# EasyEDA Pro project SAM-2.eprj, schematic Schematic1

## Sheets
1 Universal Inputs: Board Name: SAM-25; Create Date: 2026-07-15; Page Name: Universal Inputs; Project Name: SAM-2; Schematic Name: Schematic1; Update Date: 2026-08-26; Company: ZyntelliTech Development LLC; Drawn: Stephen Long Jr; Page Size: A4; Version: V1.0
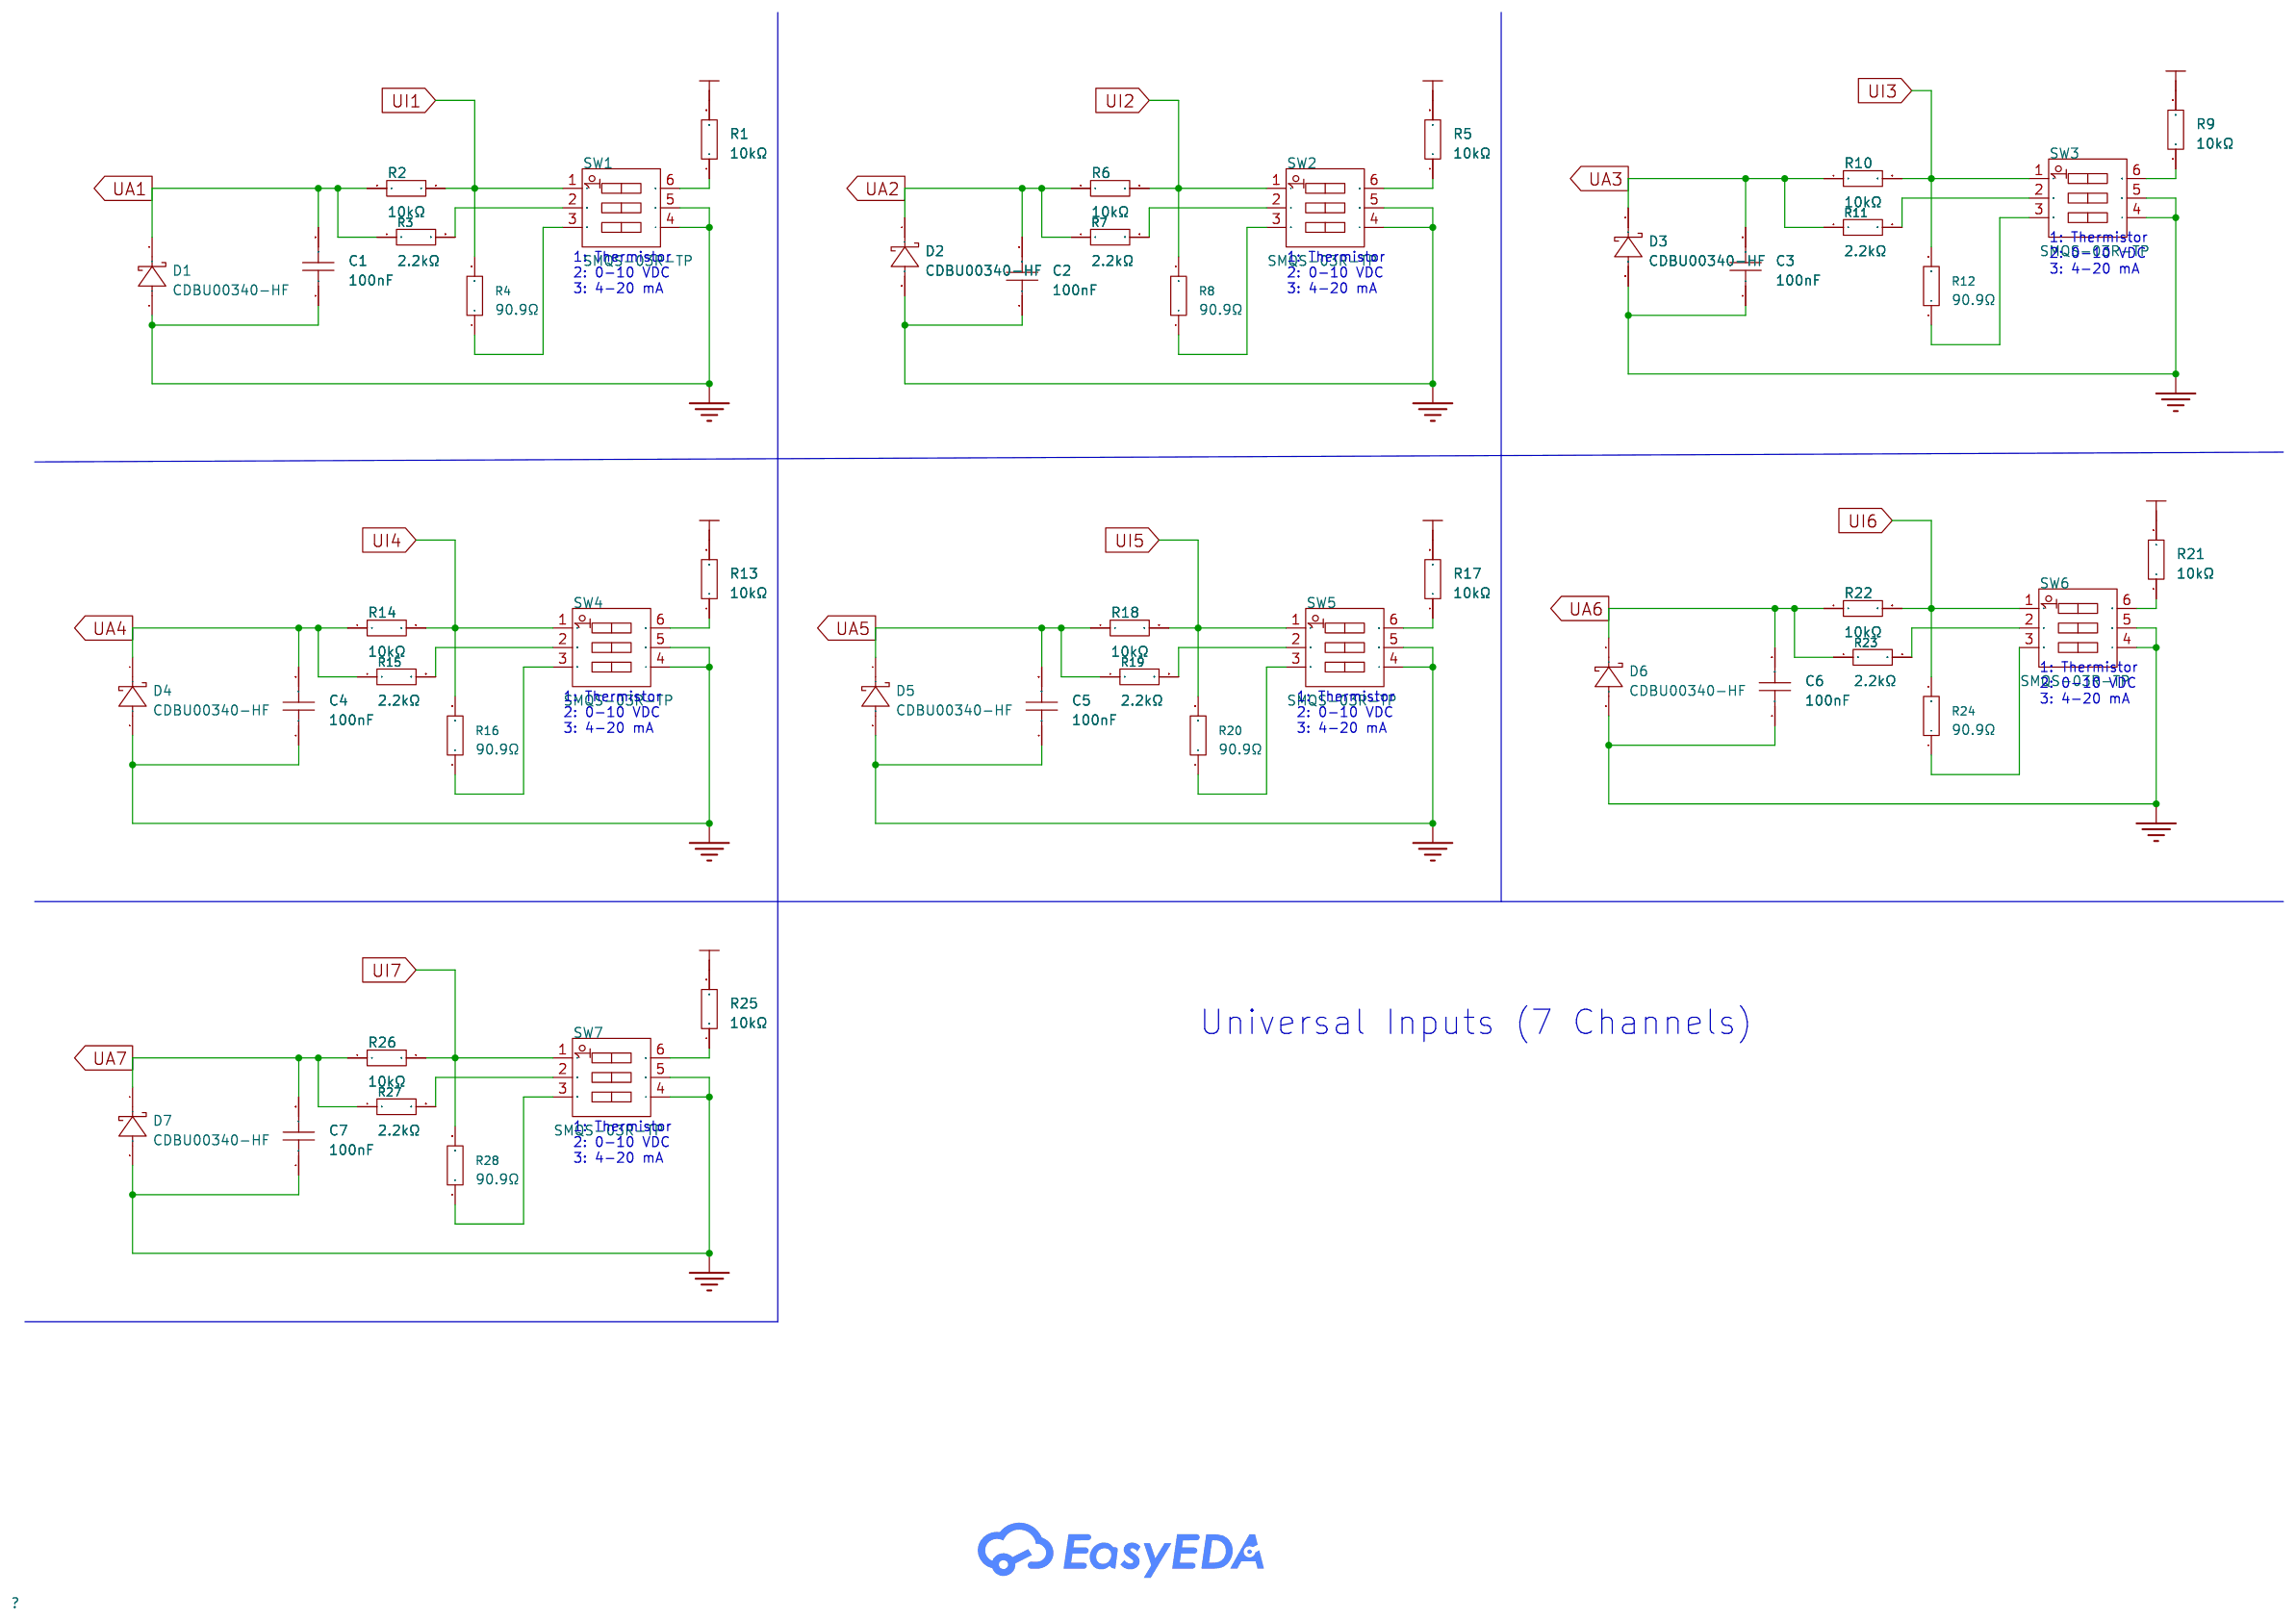
[diagram p9: Universal Inputs]
2 Analog Outputs: Page Name: Analog Outputs; Update Date: 2026-08-12
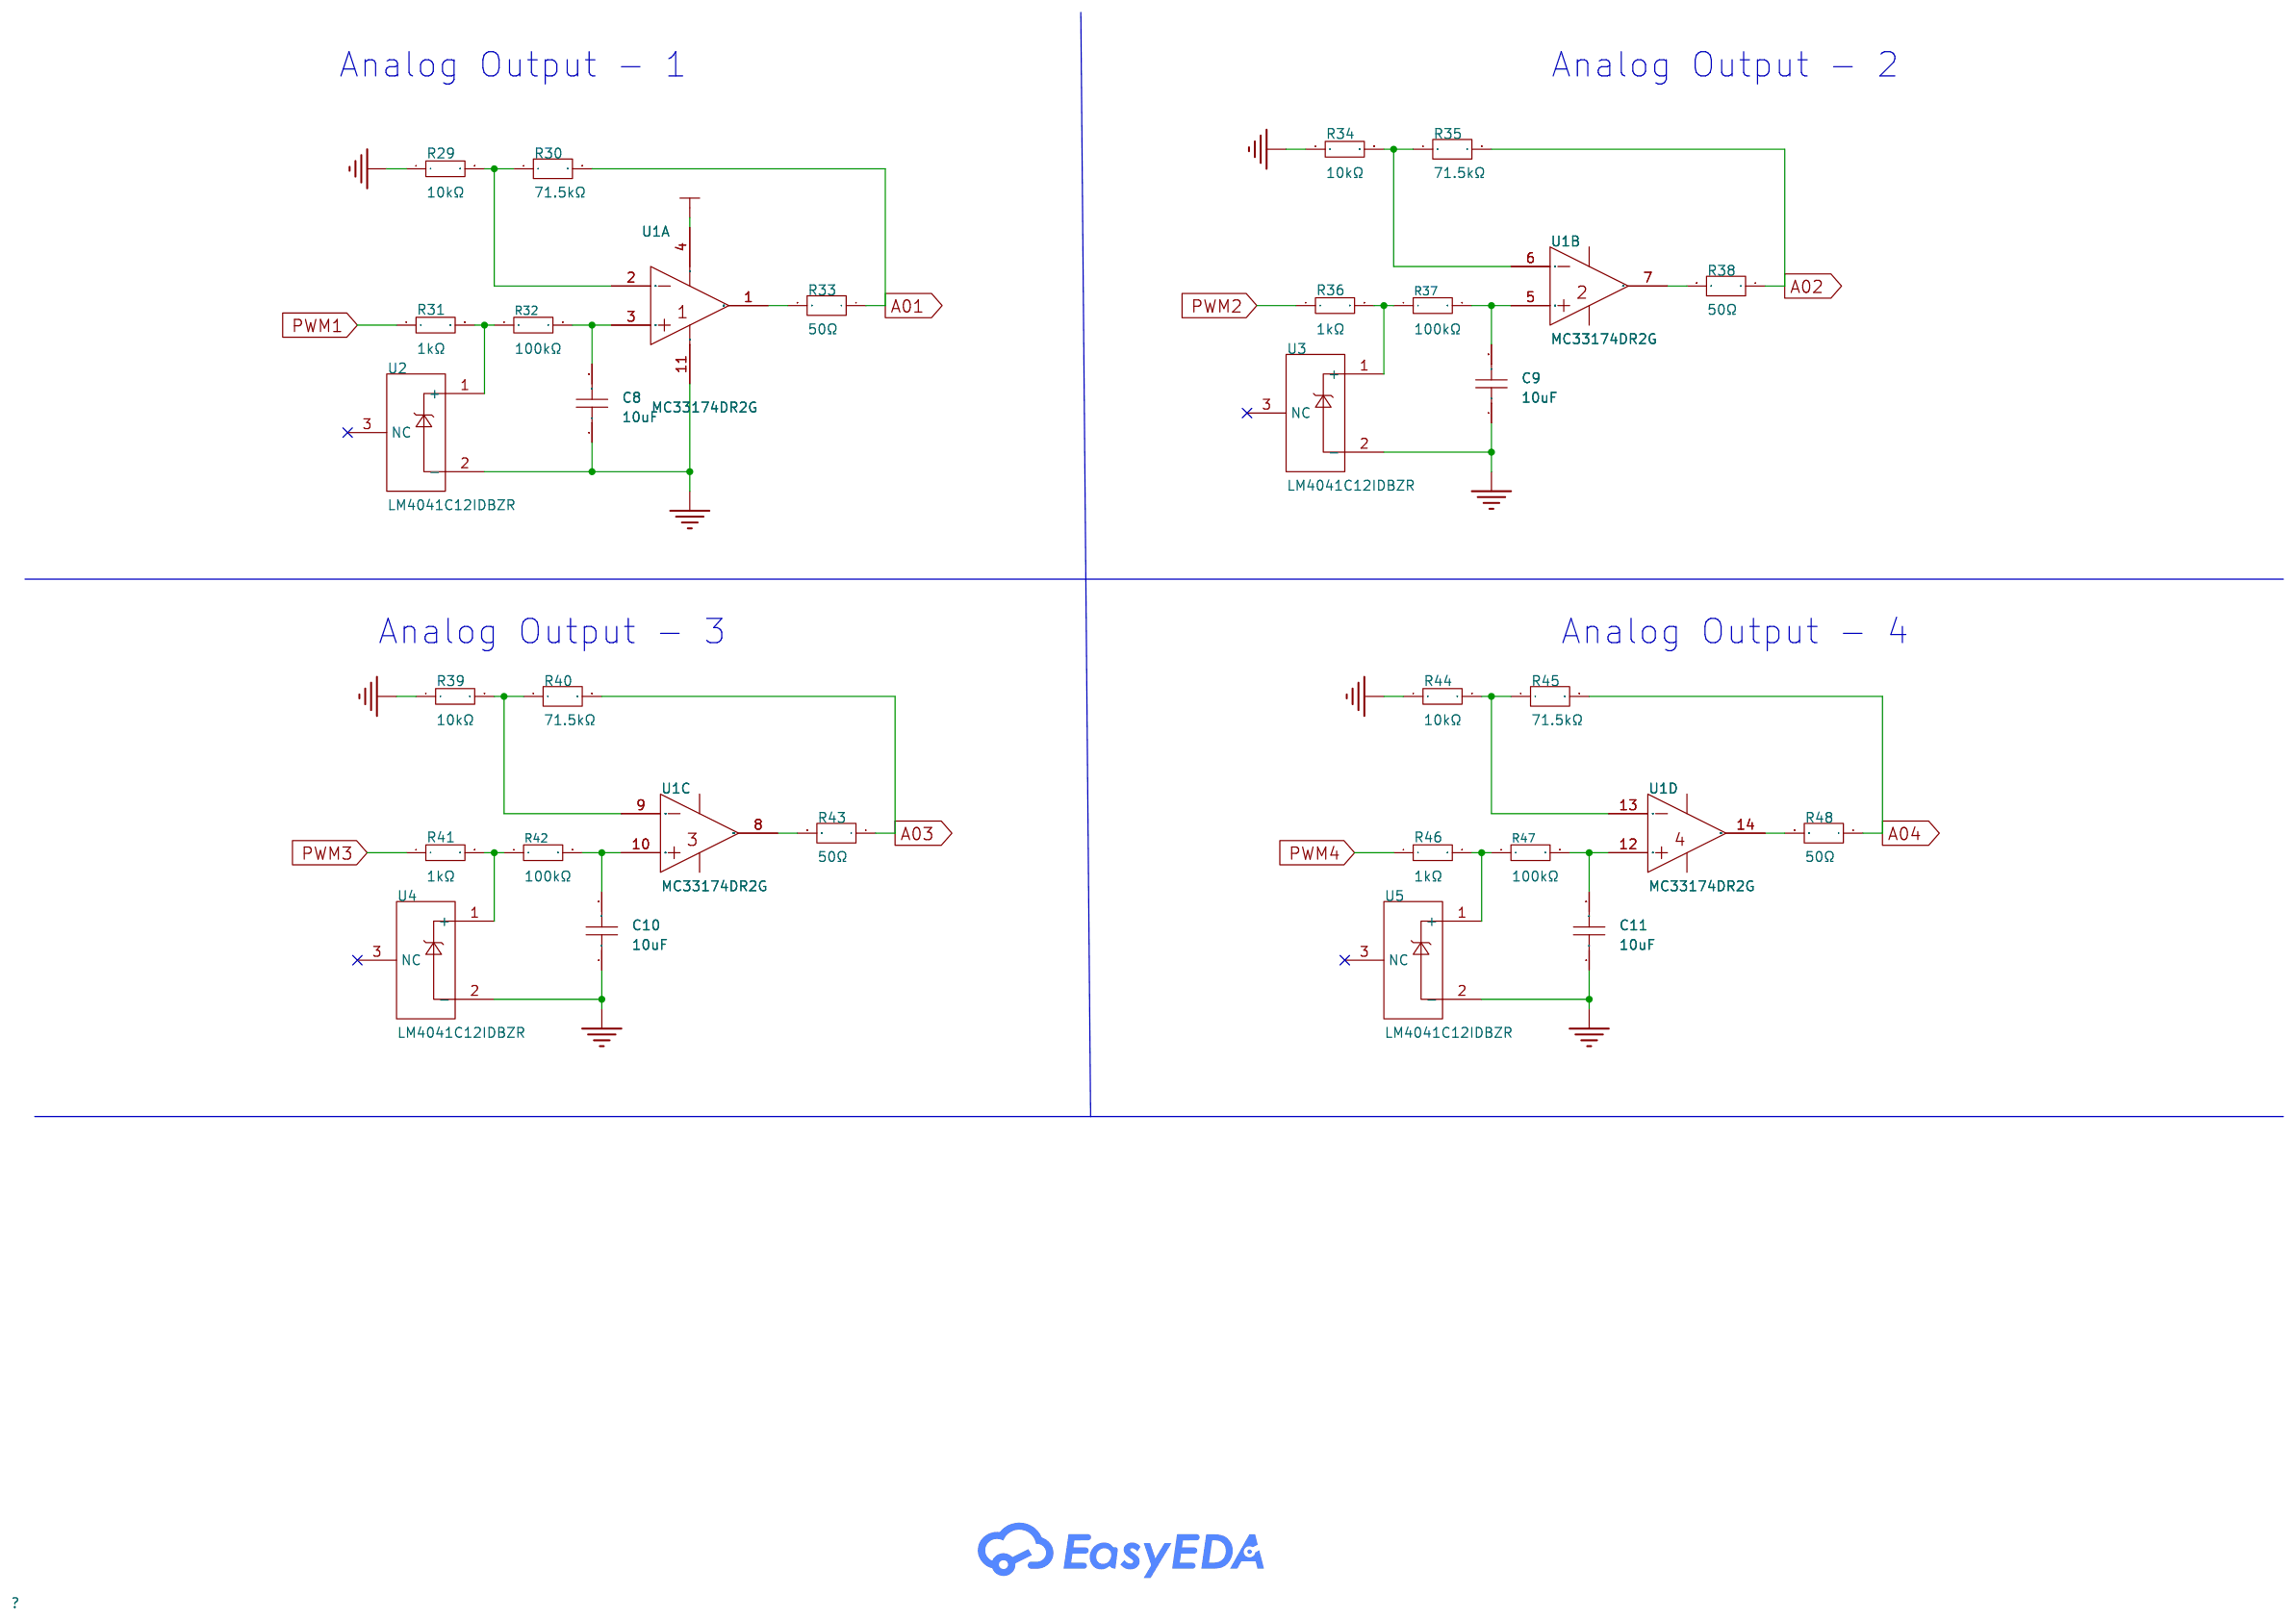
[diagram p10: Analog Outputs]
3 Triac: Page Name: Triac; Update Date: 2026-08-12
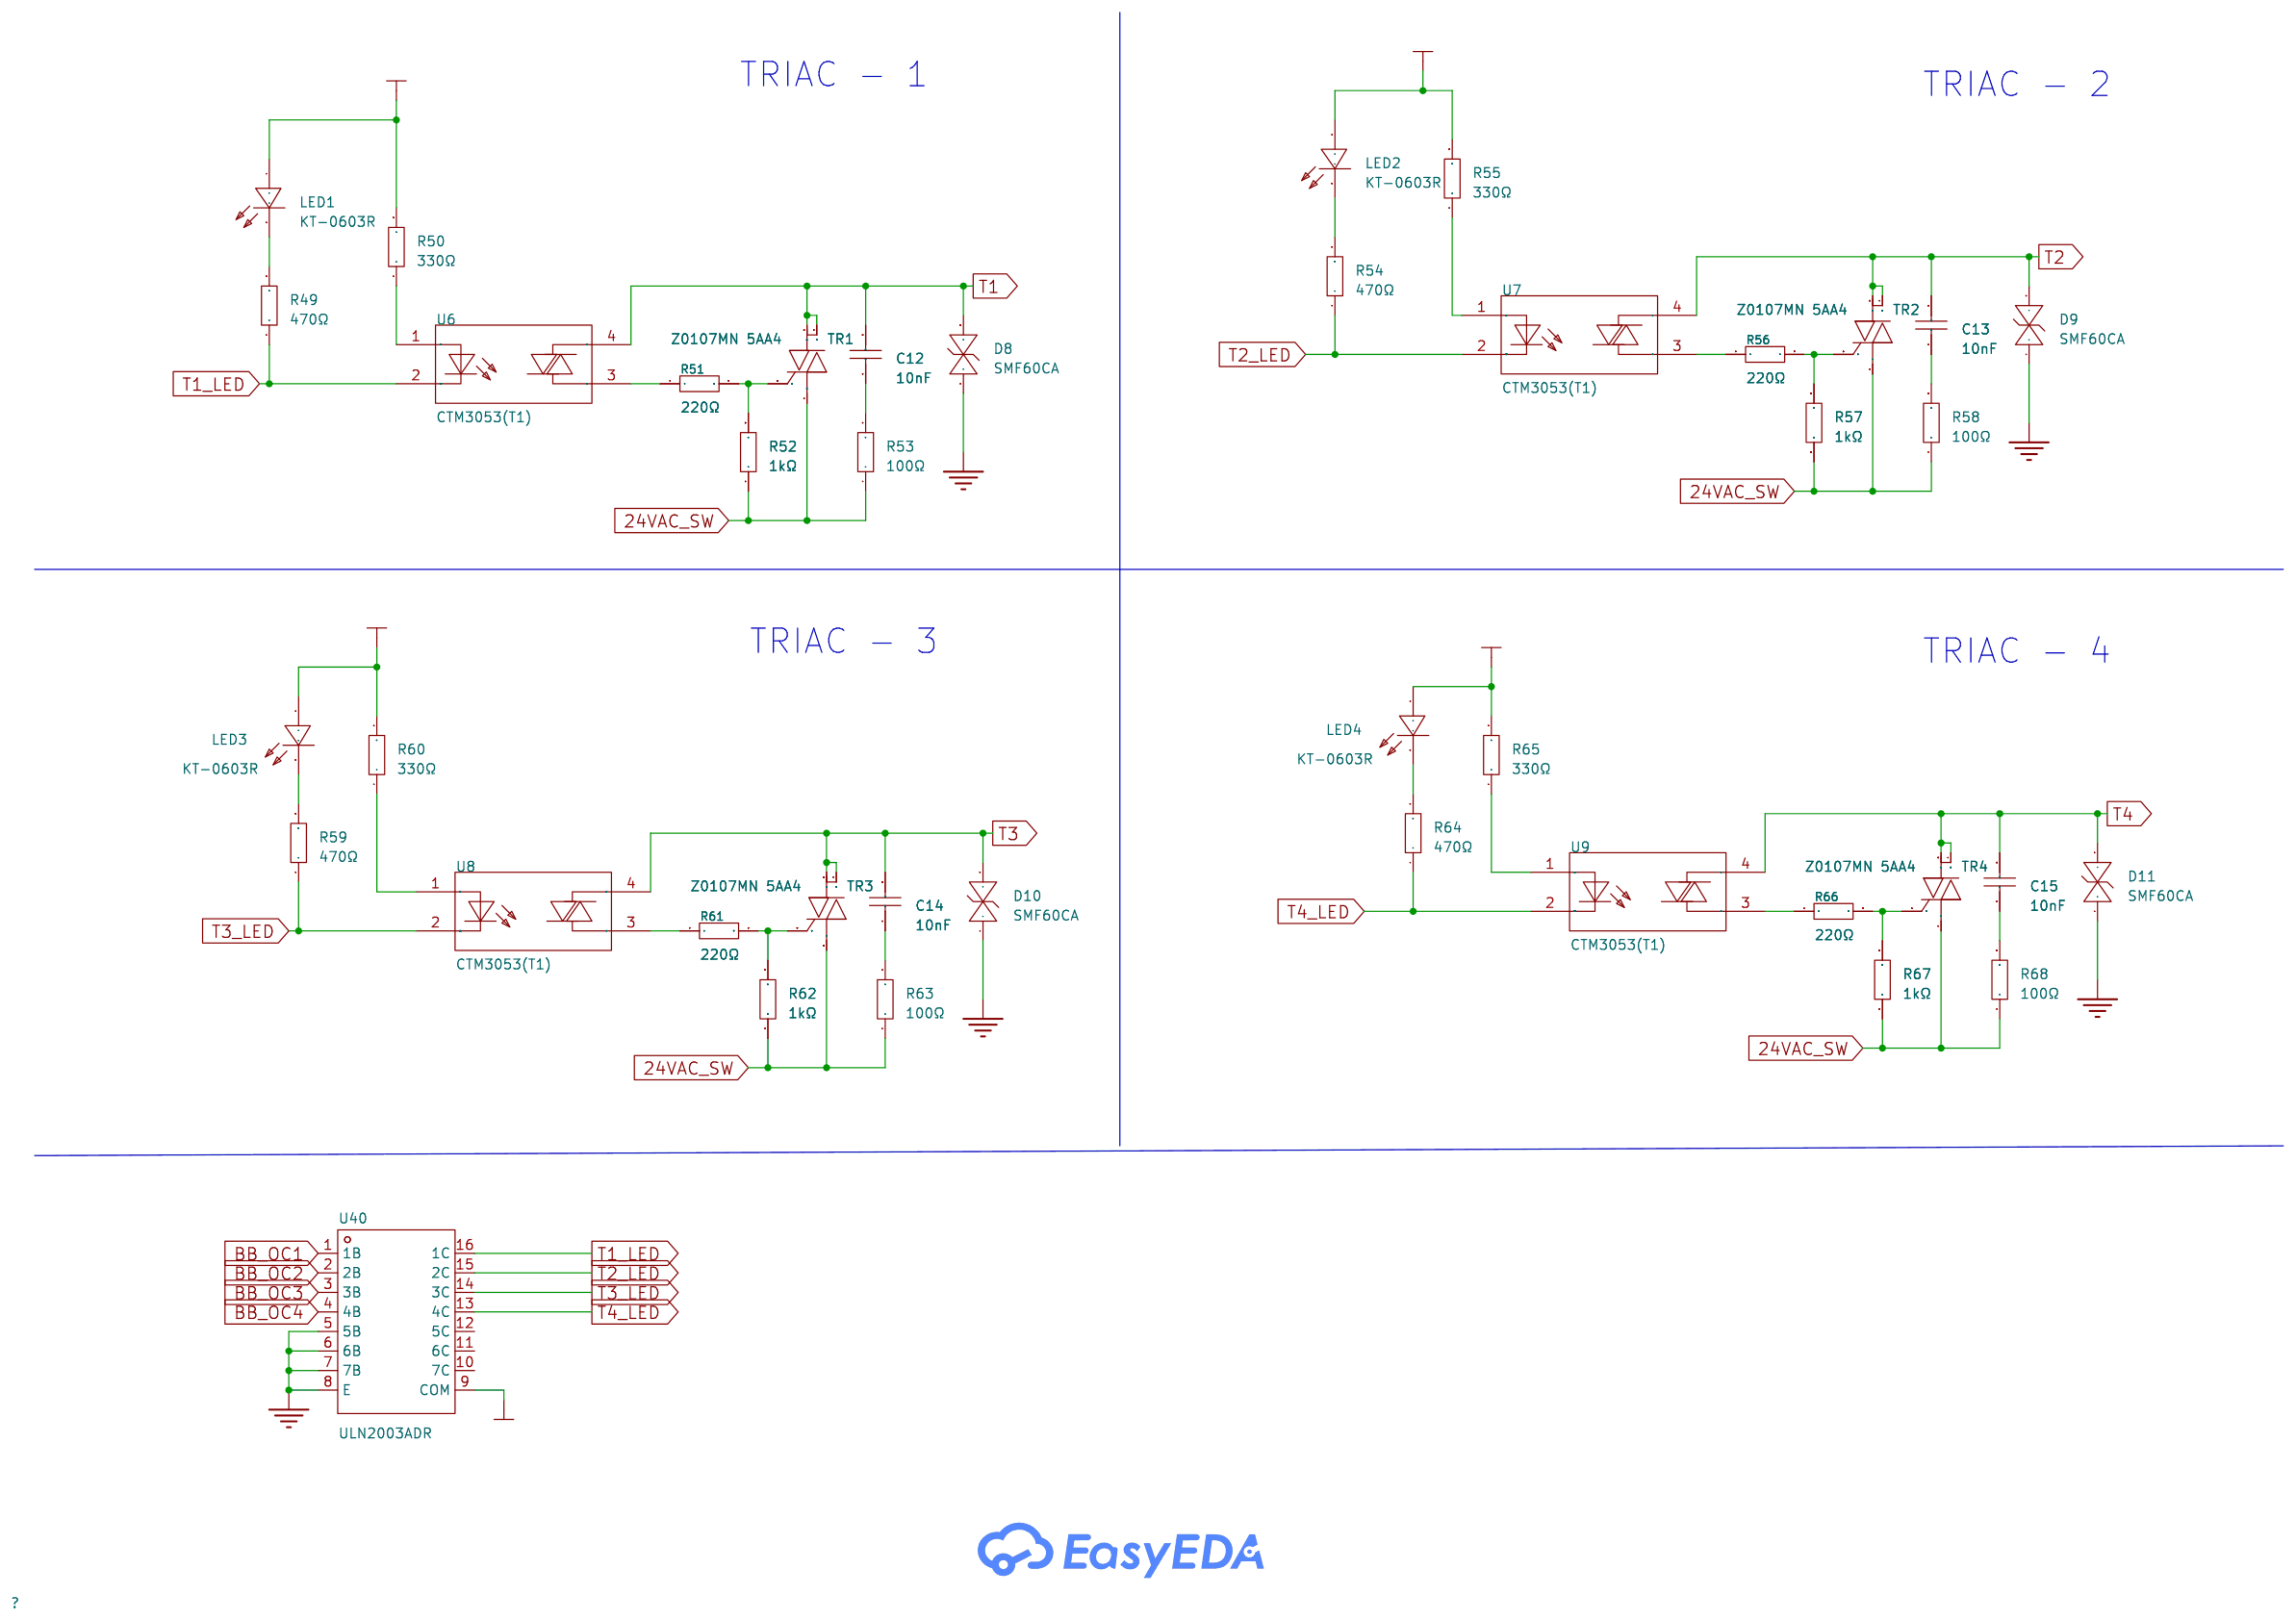
[diagram p11: Triac]
4 Power Circuit: Page Name: Power Circuit; Update Date: 2026-09-17
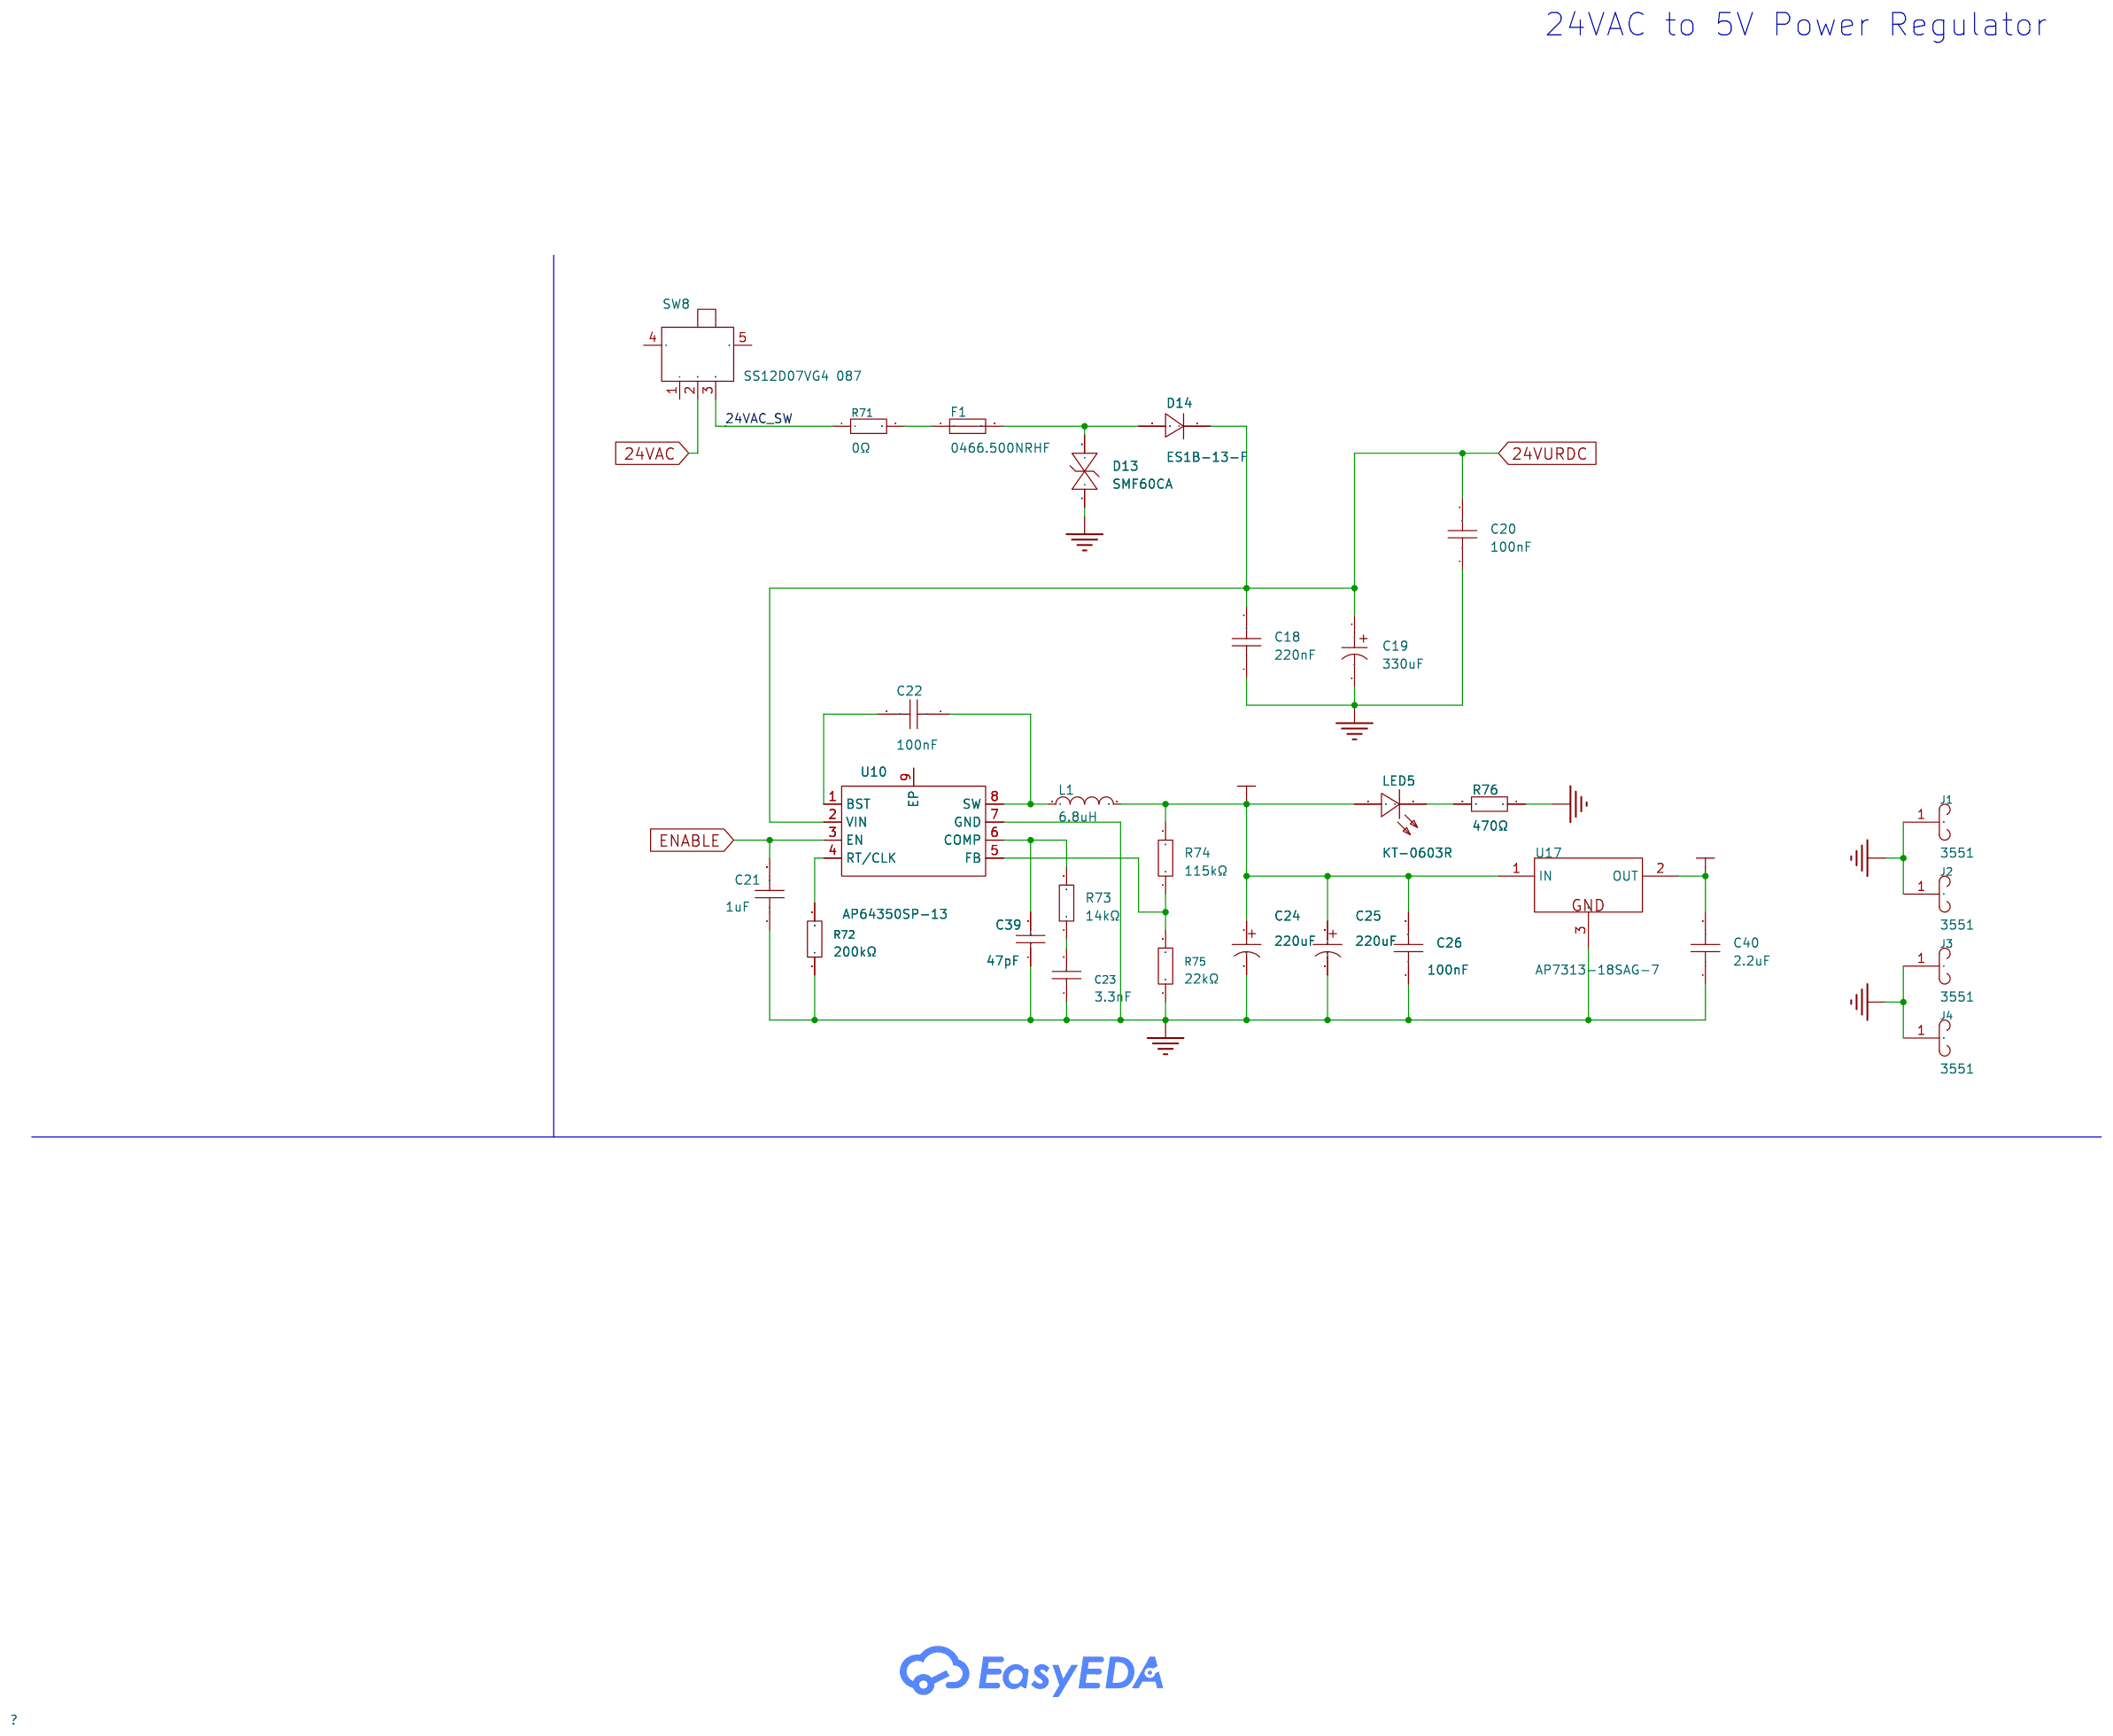
[diagram p12: Power Circuit]
5 Connectors: Page Name: Connectors; Update Date: 2026-09-02
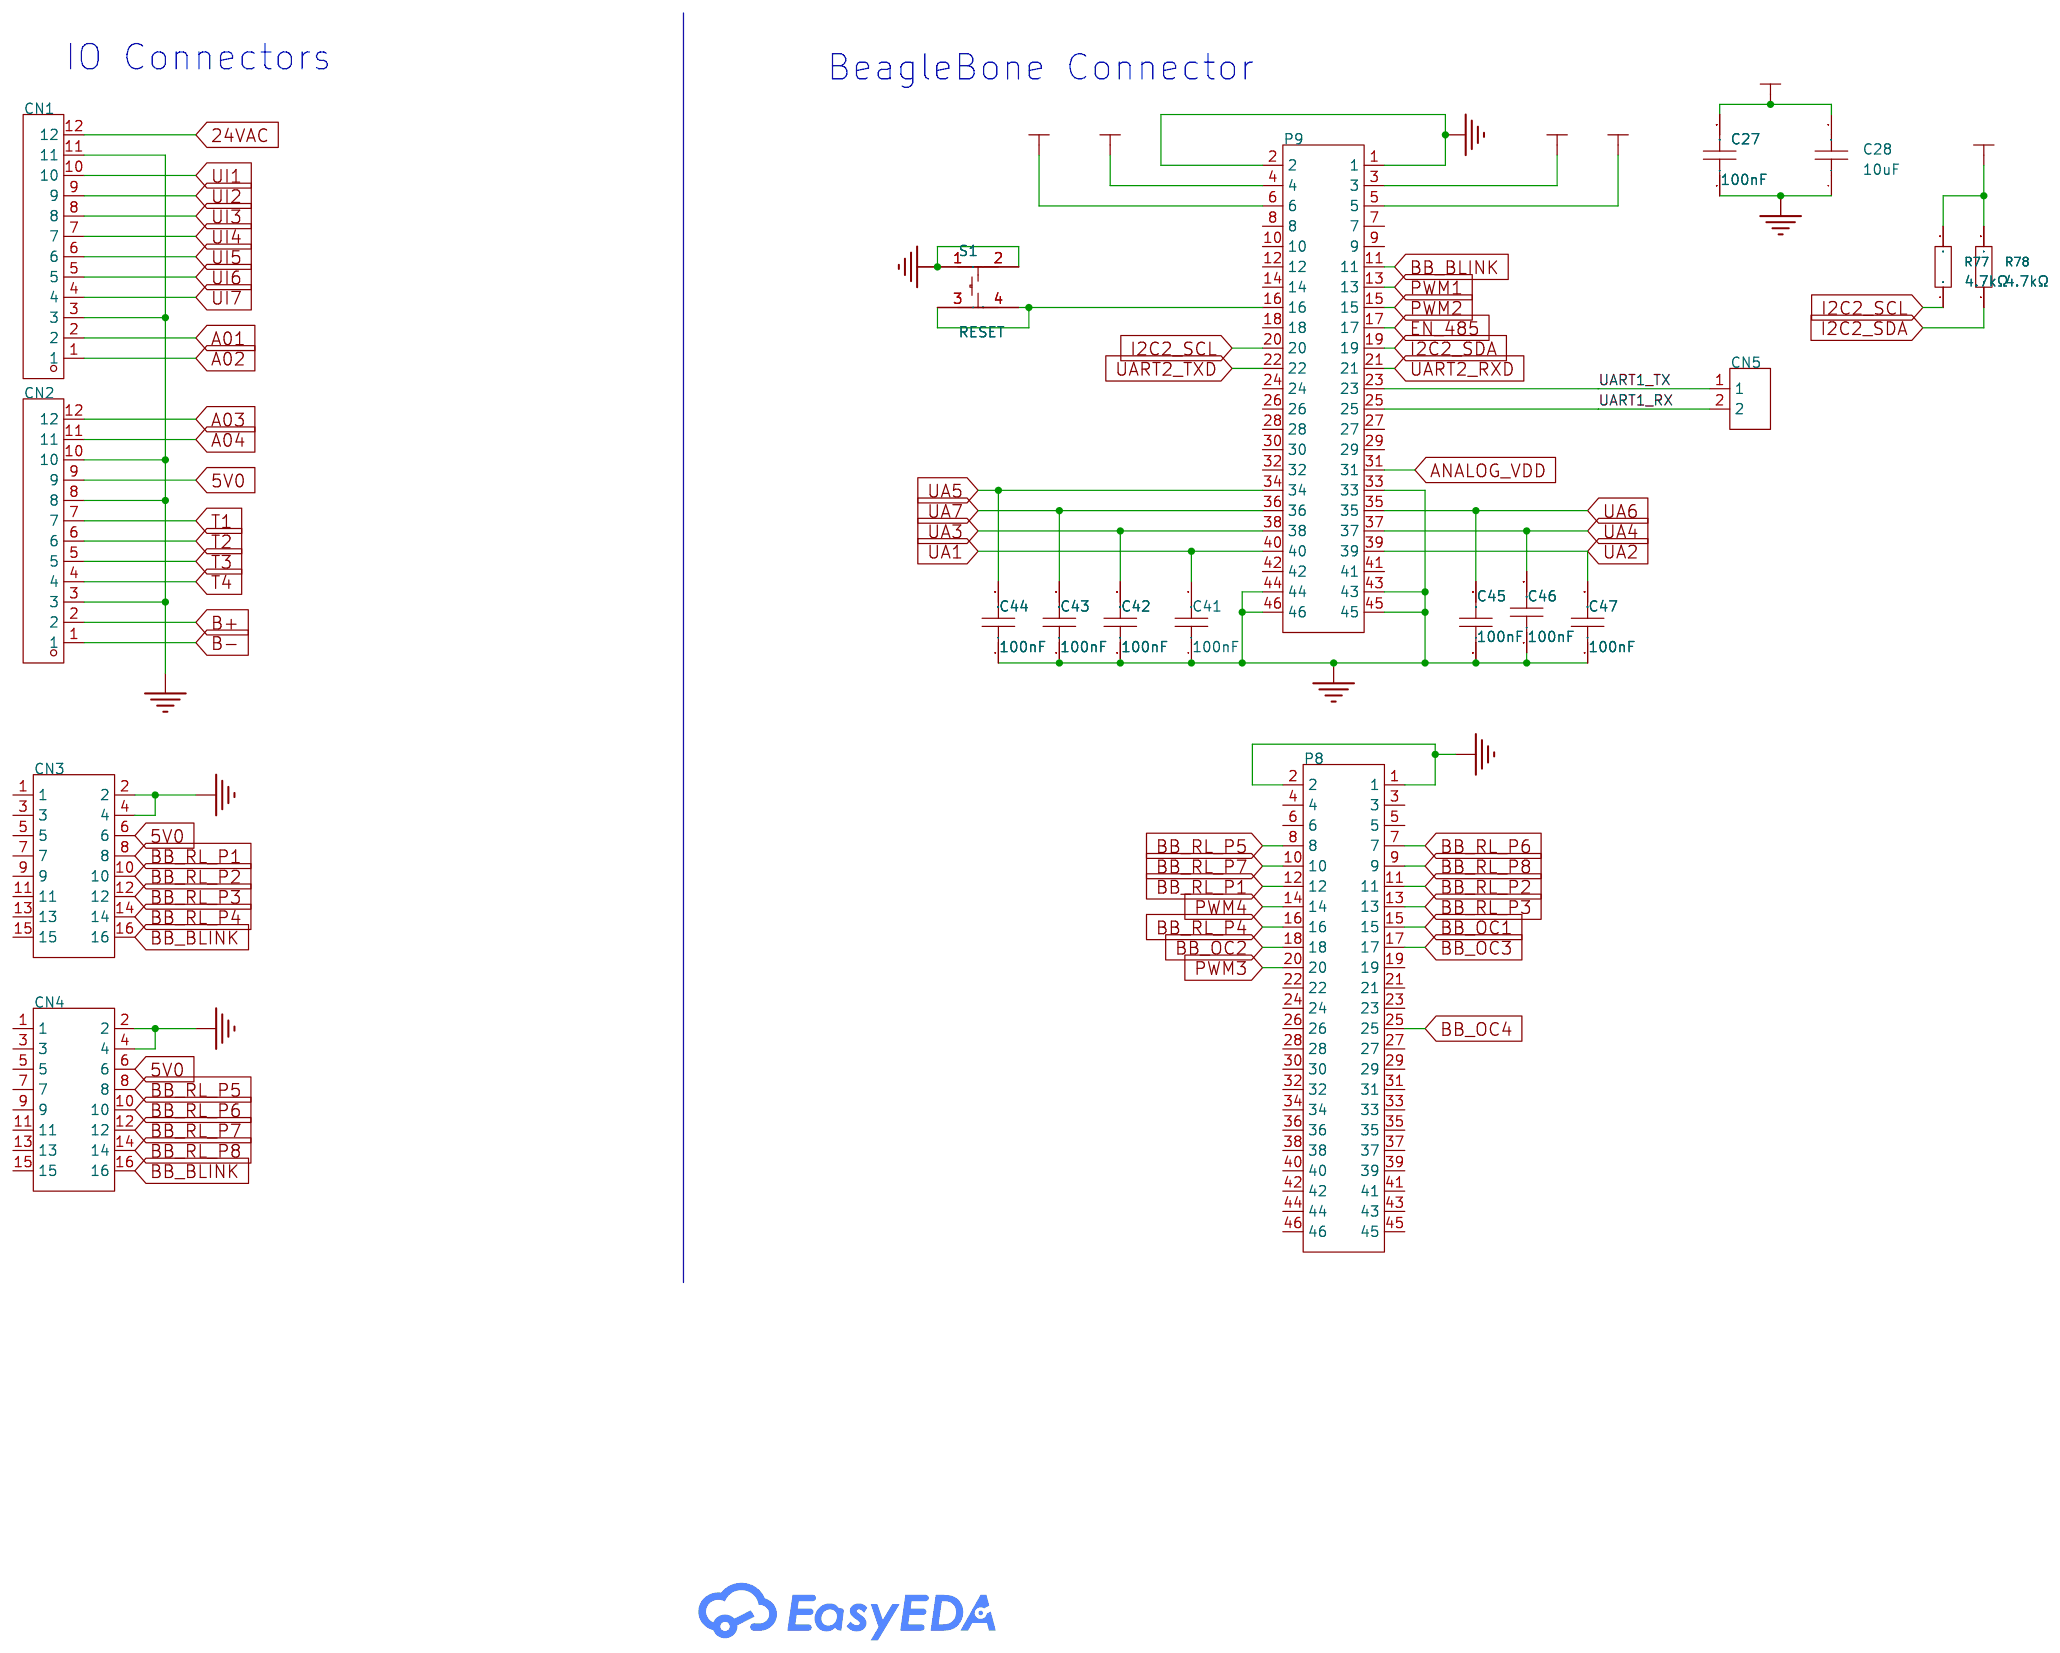
[diagram p13: Connectors]
6 RS485_RTC: Create Date: 2026-08-12; Page Name: RS485_RTC; Company: EasyEDA.com
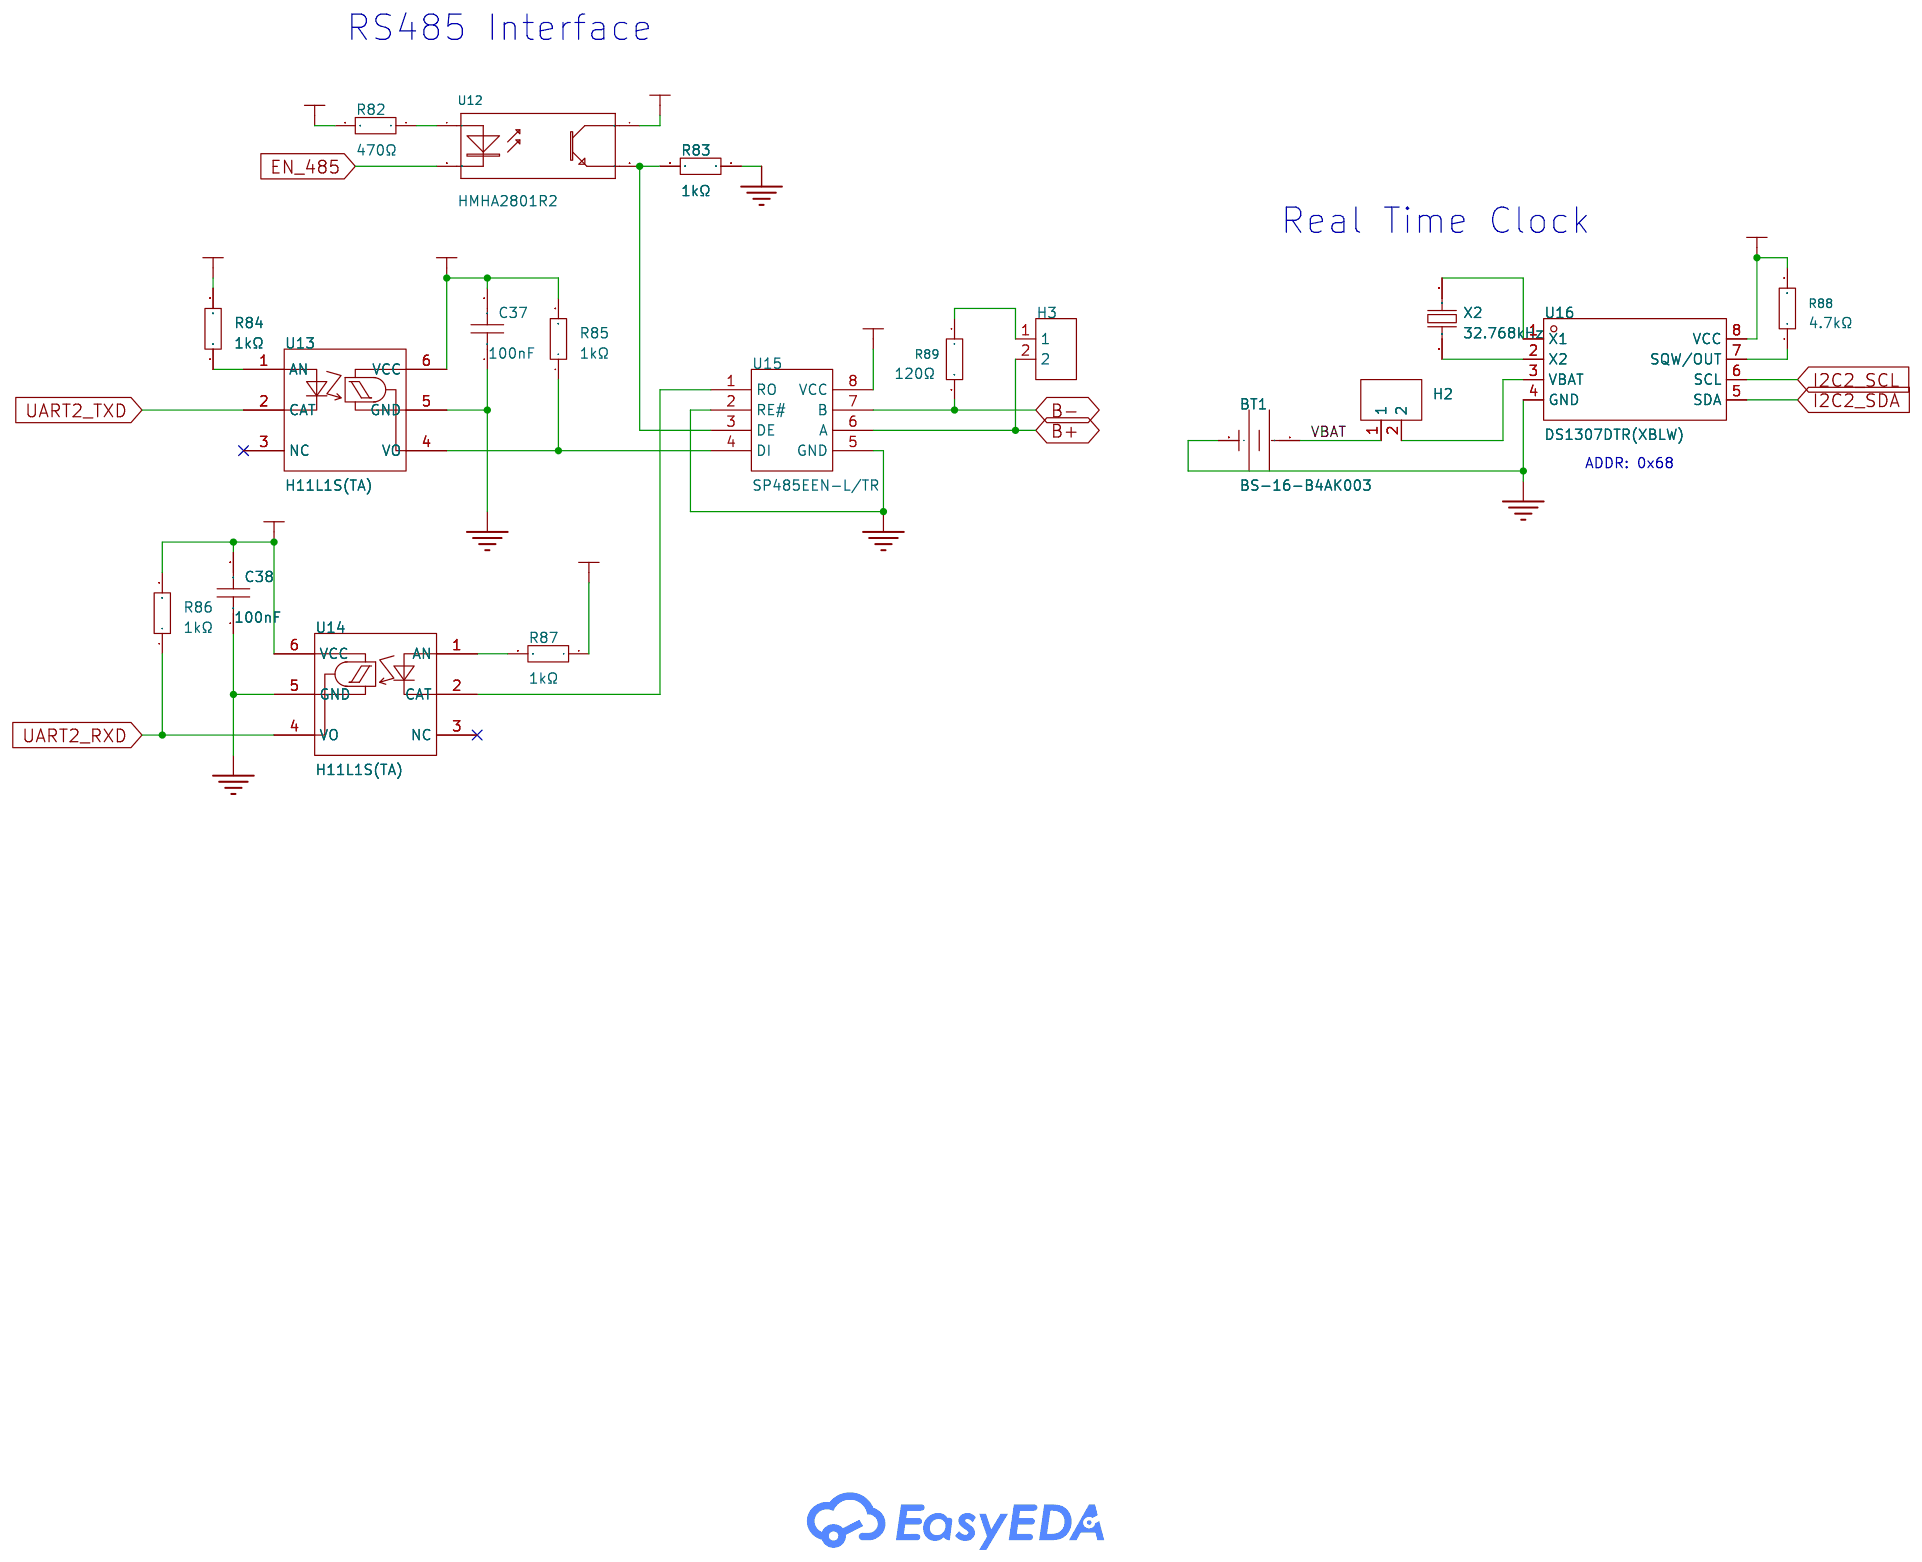
[diagram p14: RS485_RTC]
7 RJ45 Sensor: Create Date: 2026-09-02; Page Name: RJ45 Sensor; Update Date: 2026-09-03; Company: EasyEDA.com
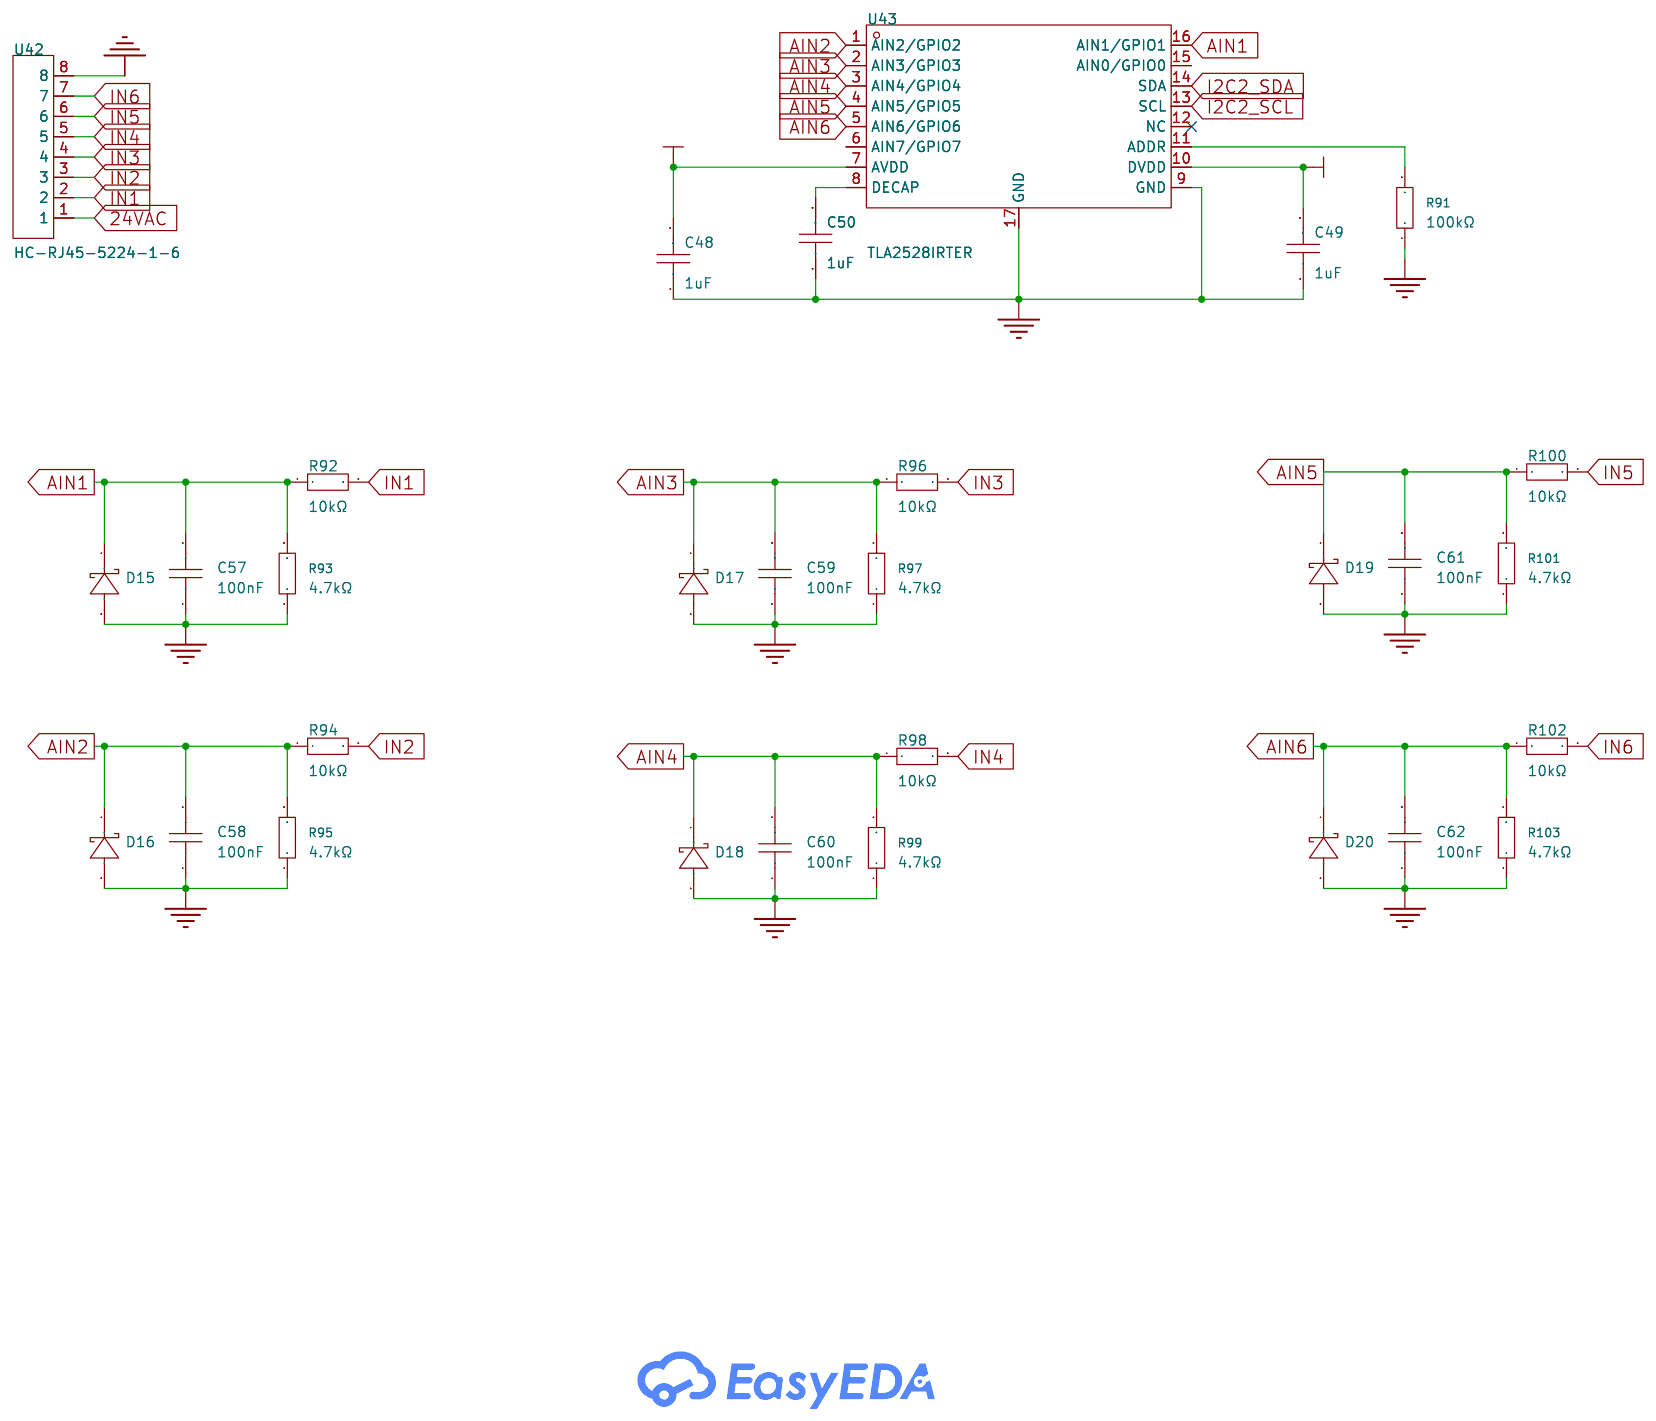
[diagram p15: RJ45 Sensor]
8 WDT: Create Date: 2026-09-17; Page Name: WDT; Update Date: 2026-09-17; Company: EasyEDA.com
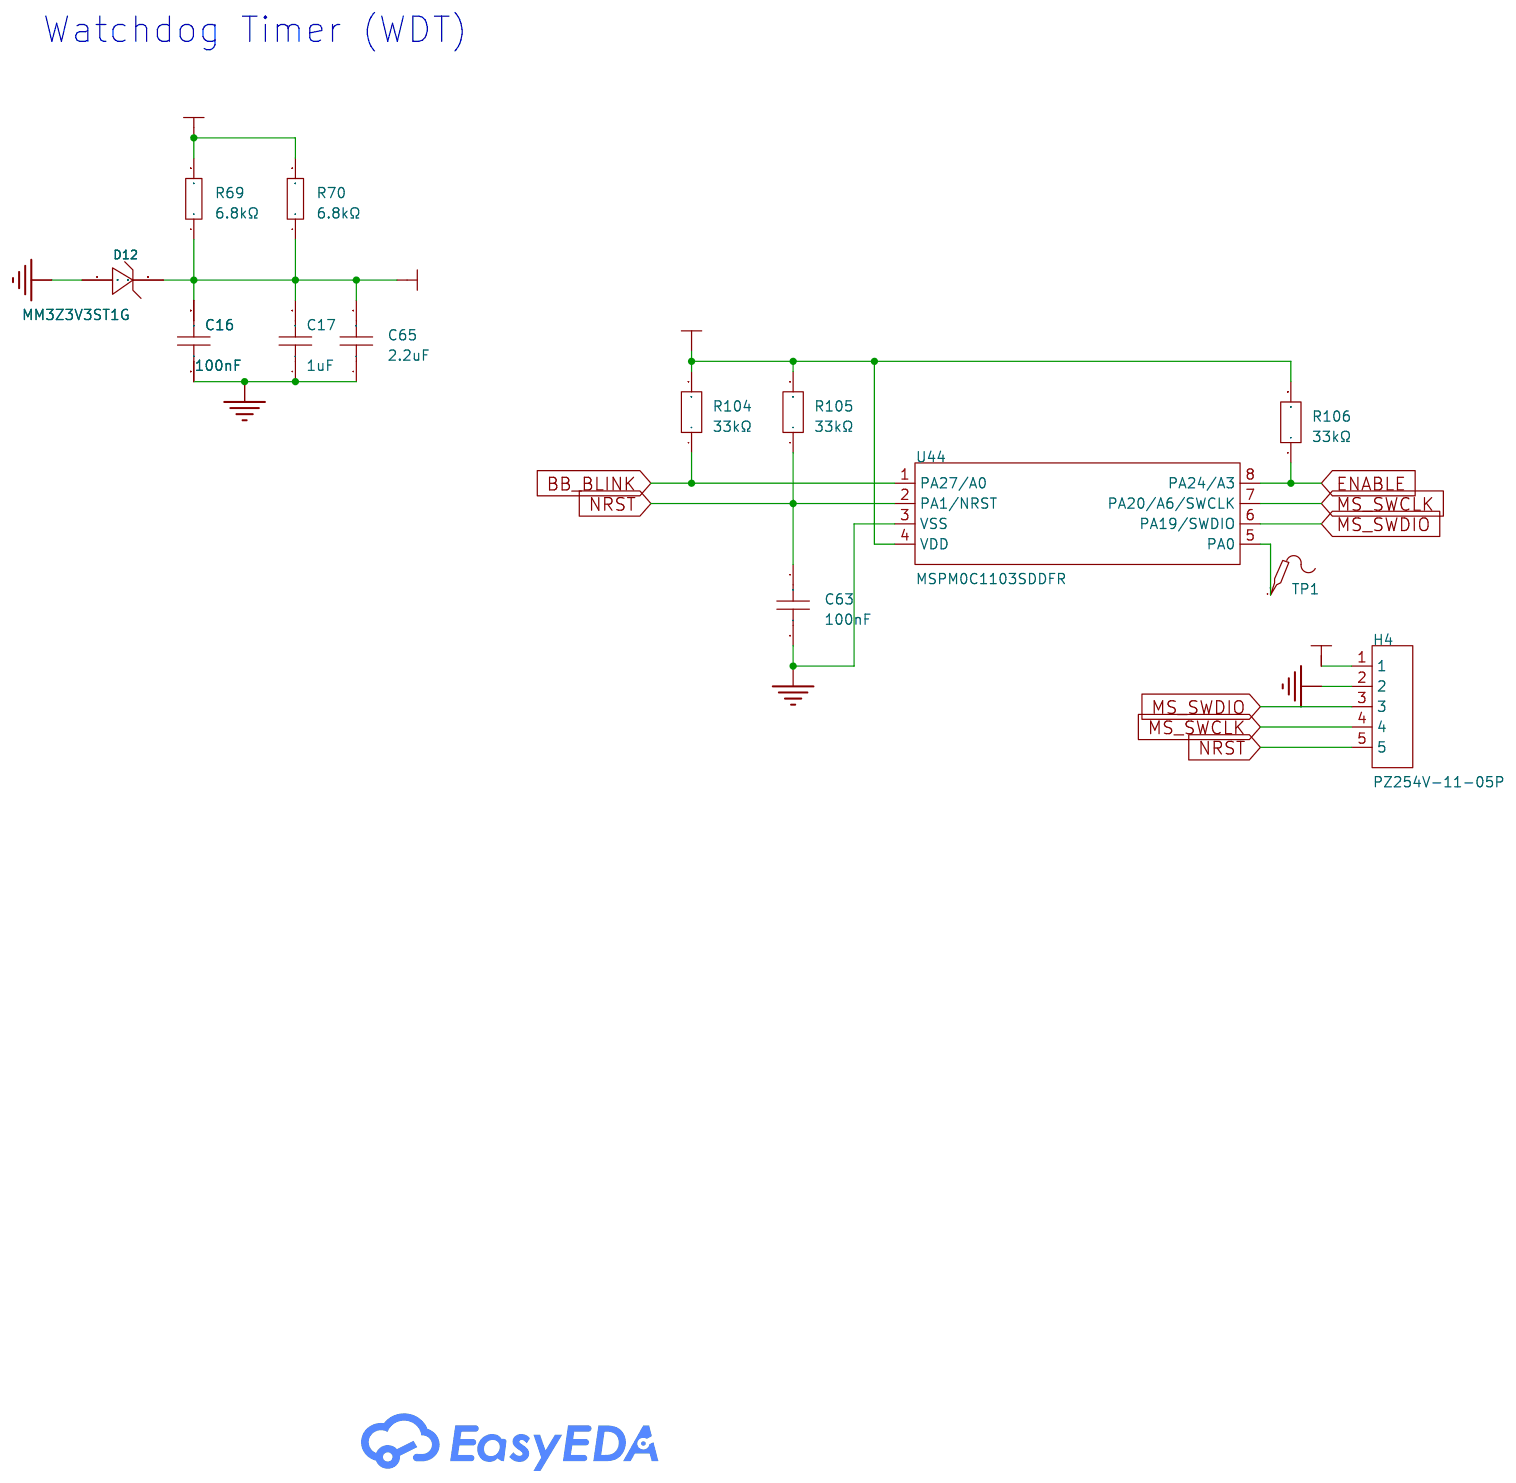
[diagram p16: WDT]

## Parts
sheet Analog Outputs
C8  10uF  [C0402]
C9  10uF  [C0402]
C10  10uF  [C0402]
C11  10uF  [C0402]
R29  10kΩ  [R0402]
R30  71.5kΩ  [R0402]
R31  1kΩ  [R0402]
R32  100kΩ  [R0402]
R33  50Ω  [R0603]
R34  10kΩ  [R0402]
R35  71.5kΩ  [R0402]
R36  1kΩ  [R0402]
R37  100kΩ  [R0402]
R38  50Ω  [R0603]
R39  10kΩ  [R0402]
R40  71.5kΩ  [R0402]
R41  1kΩ  [R0402]
R42  100kΩ  [R0402]
R43  50Ω  [R0603]
R44  10kΩ  [R0402]
R45  71.5kΩ  [R0402]
R46  1kΩ  [R0402]
R47  100kΩ  [R0402]
R48  50Ω  [R0603]
U1  MC33174DR2G  [SOIC-14_L8.7-W3.9-P1.27-LS6.0-BL]  (sections 1,2,3,4)
U2  LM4041C12IDBZR  [SOT-23-3_L2.9-W1.6-P1.90-LS2.8-BR]
U3  LM4041C12IDBZR  [SOT-23-3_L2.9-W1.6-P1.90-LS2.8-BR]
U4  LM4041C12IDBZR  [SOT-23-3_L2.9-W1.6-P1.90-LS2.8-BR]
U5  LM4041C12IDBZR  [SOT-23-3_L2.9-W1.6-P1.90-LS2.8-BR]
sheet Connectors
C27  100nF  [C0402]
C28  10uF  [C0603]
C41  100nF  [C0402]
C42  100nF  [C0402]
C43  100nF  [C0402]
C44  100nF  [C0402]
C45  100nF  [C0402]
C46  100nF  [C0402]
C47  100nF  [C0402]
CN1  KF2EDGV-3.5-12P  [CONN-TH_12P-P3.50_KF2EDGV-3.5-12P]
CN2  KF2EDGV-3.5-12P  [CONN-TH_12P-P3.50_KF2EDGV-3.5-12P]
CN3  PZ254V-12-16P  [HDR-TH_16P-P2.54-V-M-R2-C8-S2.54]
CN4  PZ254V-12-16P  [HDR-TH_16P-P2.54-V-M-R2-C8-S2.54]
CN5  JP2  [HDR-TH_2P-P2.54-V-M]
P8  X6521WV-2x23H-C60D30  [HDR-TH_46P-2.54-V-M-R2-C23-S2.54]
P9  X6521WV-2x23H-C60D30  [HDR-TH_46P-2.54-V-M-R2-C23-S2.54]
R77  4.7kΩ  [R0402]
R78  4.7kΩ  [R0402]
S1  RESET  [KEY-SMD_4P-L6.0-W6.0-P4.50-LS8.6]
sheet Power Circuit
C18  220nF  [C0402]
C19  330uF  [CAP-SMD_BD10.0-L10.3-W10.3-LS11.3-FD]
C20  100nF  [C0402]
C21  1uF  [C0603]
C22  100nF  [C0402]
C23  3.3nF  [C0402]
C24  220uF  [CAP-SMD_BD6.3-L6.6-W6.6-FD]
C25  220uF  [CAP-SMD_BD6.3-L6.6-W6.6-FD]
C26  100nF  [C0402]
C39  47pF  [C0402]
C40  2.2uF  [C0402]
D13  SMF60CA  [SOD-123FL_L2.8-W1.8-LS3.7-BI]
D14  ES1B-13-F  [SMA_L4.4-W2.8-LS5.4-RD]
F1  0466.500NRHF  [F1206]
J1  3551  [CONN-TH_3551]
J2  3551  [CONN-TH_3551]
J3  3551  [CONN-TH_3551]
J4  3551  [CONN-TH_3551]
L1  6.8uH  [IND-SMD_L5.8-W5.2]
LED5  KT-0603R  [LED-SMD_L1.6-W0.8-R-RD]
R71  0Ω  [R1206]
R72  200kΩ  [R0402]
R73  14kΩ  [R0402]
R74  115kΩ  [R0402]
R75  22kΩ  [R0402]
R76  470Ω  [R0603]
SW8  SS12D07VG4 087  [SW-TH_SS12D07VG4]
U10  AP64350SP-13  [SO-8_L4.9-W3.9-P1.27-LS6.0-BL-EP]
U17  AP7313-18SAG-7  [SOT-23-3_L2.9-W1.3-P1.90-LS2.4-BR]
sheet RJ45 Sensor
C48  1uF  [C0603]
C49  1uF  [C0603]
C50  1uF  [C0603]
C57  100nF  [C0402]
C58  100nF  [C0402]
C59  100nF  [C0402]
C60  100nF  [C0402]
C61  100nF  [C0402]
C62  100nF  [C0402]
D15  CDBU00340-HF  [SOD-523F_L1.7-W0.9-LS1.7-RD]
D16  CDBU00340-HF  [SOD-523F_L1.7-W0.9-LS1.7-RD]
D17  CDBU00340-HF  [SOD-523F_L1.7-W0.9-LS1.7-RD]
D18  CDBU00340-HF  [SOD-523F_L1.7-W0.9-LS1.7-RD]
D19  CDBU00340-HF  [SOD-523F_L1.7-W0.9-LS1.7-RD]
D20  CDBU00340-HF  [SOD-523F_L1.7-W0.9-LS1.7-RD]
R91  100kΩ  [R0402]
R92  10kΩ  [R0402]
R93  4.7kΩ  [R0402]
R94  10kΩ  [R0402]
R95  4.7kΩ  [R0402]
R96  10kΩ  [R0402]
R97  4.7kΩ  [R0402]
R98  10kΩ  [R0402]
R99  4.7kΩ  [R0402]
R100  10kΩ  [R0402]
R101  4.7kΩ  [R0402]
R102  10kΩ  [R0402]
R103  4.7kΩ  [R0402]
U42  HC-RJ45-5224-1-6  [RJ45-TH_HCTL_HC-RJ45-5224-1-6]
U43  TLA2528IRTER  [WQFN-16_L3.0-W3.0-P0.50-TL-EP1.7]
sheet RS485_RTC
BT1  BS-16-B4AK003  [BAT-SMD_BS-16-B4AK005]
C37  100nF  [C0402]
C38  100nF  [C0402]
H2  PZ254V-11-02P  [HDR-TH_2P-P2.54-V-M]
H3  PZ254V-11-02P  [HDR-TH_2P-P2.54-V-M]
R82  470Ω  [R0603]
R83  1kΩ  [R0402]
R84  1kΩ  [R0402]
R85  1kΩ  [R0402]
R86  1kΩ  [R0402]
R87  1kΩ  [R0402]
R88  4.7kΩ  [R0402]
R89  120Ω  [R0603]
U12  HMHA2801R2  [SMD-4_L2.7-W4.4-P1.27-LS7.0-BL]
U13  H11L1S(TA)  [SMD-6_L7.3-W6.5-P2.54-LS10.2-BL]
U14  H11L1S(TA)  [SMD-6_L7.3-W6.5-P2.54-LS10.2-BL]
U15  SP485EEN-L/TR  [SOIC-8_L5.0-W4.0-P1.27-LS6.0-BL]
U16  DS1307DTR(XBLW)  [SOP-8_L4.9-W3.9-P1.27-LS6.0-BL]
X2  32.768kHz  [FC-135R_L3.2-W1.5]
sheet Triac
C12  10nF  [C0603]
C13  10nF  [C0603]
C14  10nF  [C0603]
C15  10nF  [C0603]
D8  SMF60CA  [SOD-123FL_L2.8-W1.8-LS3.7-BI]
D9  SMF60CA  [SOD-123FL_L2.8-W1.8-LS3.7-BI]
D10  SMF60CA  [SOD-123FL_L2.8-W1.8-LS3.7-BI]
D11  SMF60CA  [SOD-123FL_L2.8-W1.8-LS3.7-BI]
LED1  KT-0603R  [LED-SMD_L1.6-W0.8-R-RD]
LED2  KT-0603R  [LED-SMD_L1.6-W0.8-R-RD]
LED3  KT-0603R  [LED-SMD_L1.6-W0.8-R-RD]
LED4  KT-0603R  [LED-SMD_L1.6-W0.8-R-RD]
R49  470Ω  [R0603]
R50  330Ω  [R0603]
R51  220Ω  [R0603]
R52  1kΩ  [R0603]
R53  100Ω  [R0603]
R54  470Ω  [R0603]
R55  330Ω  [R0603]
R56  220Ω  [R0603]
R57  1kΩ  [R0603]
R58  100Ω  [R0603]
R59  470Ω  [R0603]
R60  330Ω  [R0603]
R61  220Ω  [R0603]
R62  1kΩ  [R0603]
R63  100Ω  [R0603]
R64  470Ω  [R0603]
R65  330Ω  [R0603]
R66  220Ω  [R0603]
R67  1kΩ  [R0603]
R68  100Ω  [R0603]
TR1  Z0107MN 5AA4  [SOT-223_L6.7-W3.5-P2.30-BR]
TR2  Z0107MN 5AA4  [SOT-223_L6.7-W3.5-P2.30-BR]
TR3  Z0107MN 5AA4  [SOT-223_L6.7-W3.5-P2.30-BR]
TR4  Z0107MN 5AA4  [SOT-223_L6.7-W3.5-P2.30-BR]
U6  CTM3053(T1)  [SOP-4_L3.6-W4.4-P2.54-LS7.0-TL]
U7  CTM3053(T1)  [SOP-4_L3.6-W4.4-P2.54-LS7.0-TL]
U8  CTM3053(T1)  [SOP-4_L3.6-W4.4-P2.54-LS7.0-TL]
U9  CTM3053(T1)  [SOP-4_L3.6-W4.4-P2.54-LS7.0-TL]
U40  ULN2003ADR  [SOIC-16_L9.9-W3.9-P1.27-LS6.0-BL]
sheet Universal Inputs
C1  100nF  [C0402]
C2  100nF  [C0402]
C3  100nF  [C0402]
C4  100nF  [C0402]
C5  100nF  [C0402]
C6  100nF  [C0402]
C7  100nF  [C0402]
D1  CDBU00340-HF  [SOD-523F_L1.7-W0.9-LS1.7-RD]
D2  CDBU00340-HF  [SOD-523F_L1.7-W0.9-LS1.7-RD]
D3  CDBU00340-HF  [SOD-523F_L1.7-W0.9-LS1.7-RD]
D4  CDBU00340-HF  [SOD-523F_L1.7-W0.9-LS1.7-RD]
D5  CDBU00340-HF  [SOD-523F_L1.7-W0.9-LS1.7-RD]
D6  CDBU00340-HF  [SOD-523F_L1.7-W0.9-LS1.7-RD]
D7  CDBU00340-HF  [SOD-523F_L1.7-W0.9-LS1.7-RD]
R1  10kΩ  [R0402]
R2  10kΩ  [R0402]
R3  2.2kΩ  [R0402]
R4  90.9Ω  [R0402]
R5  10kΩ  [R0402]
R6  10kΩ  [R0402]
R7  2.2kΩ  [R0402]
R8  90.9Ω  [R0402]
R9  10kΩ  [R0402]
R10  10kΩ  [R0402]
R11  2.2kΩ  [R0402]
R12  90.9Ω  [R0402]
R13  10kΩ  [R0402]
R14  10kΩ  [R0402]
R15  2.2kΩ  [R0402]
R16  90.9Ω  [R0402]
R17  10kΩ  [R0402]
R18  10kΩ  [R0402]
R19  2.2kΩ  [R0402]
R20  90.9Ω  [R0402]
R21  10kΩ  [R0402]
R22  10kΩ  [R0402]
R23  2.2kΩ  [R0402]
R24  90.9Ω  [R0402]
R25  10kΩ  [R0402]
R26  10kΩ  [R0402]
R27  2.2kΩ  [R0402]
R28  90.9Ω  [R0402]
SW1  SMQS-03R-TP  [SW-TH_SMQS-03B-TP]
SW2  SMQS-03R-TP  [SW-TH_SMQS-03B-TP]
SW3  SMQS-03R-TP  [SW-TH_SMQS-03B-TP]
SW4  SMQS-03R-TP  [SW-TH_SMQS-03B-TP]
SW5  SMQS-03R-TP  [SW-TH_SMQS-03B-TP]
SW6  SMQS-03R-TP  [SW-TH_SMQS-03B-TP]
SW7  SMQS-03R-TP  [SW-TH_SMQS-03B-TP]
sheet WDT
C16  100nF  [C0402]
C17  1uF  [C0603]
C63  100nF  [C0402]
C65  2.2uF  [C0402]
D12  MM3Z3V3ST1G  [SOD-323_L1.7-W1.3-LS2.5-RD]
H4  PZ254V-11-05P  [HDR-TH_5P-P2.54-V-M]
R69  6.8kΩ  [R0402]
R70  6.8kΩ  [R0402]
R104  33kΩ  [R0402]
R105  33kΩ  [R0402]
R106  33kΩ  [R0402]
TP1  -  [Test-Point-0.5mm]
U44  MSPM0C1103SDDFR  [TSOT-23-8_L2.9-W1.6-P0.65-LS2.8-BR]

## Library data of the parts
C8-C11 = CL05A106MP5NUNC_C315248: LCSC Part Name: 10uF ±20% 10V; Supplier Part: C315248; Manufacturer: SAMSUNG(三星); Manufacturer Part: CL05A106MP5NUNC; Supplier Footprint: 0402; JLCPCB Part Class: Extended Part; Datasheet: https://item.szlcsc.com/datasheet/CL05A106MP5NUNC/297154.html; Supplier: LCSC; Tolerance: ±20%; Voltage Rating: 10V; Temperature Coefficient: X5R
R1 R2 R5 R6 R9 R10 R13 R14 R17 R18 R21 R22 R25 R26 R29 R34 R39 R44 R92 R94 R96 R98 R100 R102 = 0402WGF1002TCE: LCSC Part Name: 10kΩ ±1% 62.5mW 厚膜电阻; Supplier Part: C25744; Manufacturer: UNI-ROYAL(厚声); Supplier Footprint: 0402; JLCPCB Part Class: Basic Part; Datasheet: https://item.szlcsc.com/datasheet/0402WGF1002TCE/26487.html; Supplier: LCSC; Type: Thick Film Resistor; Tolerance: ±1%; Power(Watts): 62.5mW; Voltage-Supply(Max): 50V; Temperature Coefficient: ±100ppm/℃; Operating Temperature: -55℃~+155℃
R30 R35 R40 R45 = RT0402BRD0771K5L: LCSC Part Name: 薄膜电阻 71.5kΩ ±0.1% 62.5mW; Supplier Part: C852906; Manufacturer: YAGEO(国巨); Supplier Footprint: 0402; JLCPCB Part Class: Extended Part; Datasheet: https://item.szlcsc.com/datasheet/RT0402BRD0771K5L/913228.html; Supplier: LCSC; Type: Thin Film Resistor; Tolerance: ±0.1%; Power(Watts): 62.5mW; Voltage-Supply(Max): 50V; Temperature Coefficient: ±25ppm/℃; Operating Temperature: -55℃~+155℃
R31 R36 R41 R46 R83-R87 = 0402WGF1001TCE: LCSC Part Name: 1kΩ ±1% 62.5mW 厚膜电阻; Supplier Part: C11702; Manufacturer: UNI-ROYAL(厚声); Supplier Footprint: 0402; JLCPCB Part Class: Basic Part; Datasheet: https://item.szlcsc.com/datasheet/0402WGF1001TCE/12256.html; Supplier: LCSC; Type: Thick Film Resistor; Tolerance: ±1%; Power(Watts): 62.5mW; Voltage-Supply(Max): 50V; Temperature Coefficient: ±100ppm/℃; Operating Temperature: -55℃~+155℃
R32 R37 R42 R47 R91 = 0402WGF1003TCE: LCSC Part Name: 100kΩ ±1% 62.5mW 厚膜电阻; Supplier Part: C25741; Manufacturer: UNI-ROYAL(厚声); Supplier Footprint: 0402; JLCPCB Part Class: Basic Part; Datasheet: https://item.szlcsc.com/datasheet/0402WGF1003TCE/26484.html; Supplier: LCSC; Type: Thick Film Resistor; Tolerance: ±1%; Power(Watts): 62.5mW; Voltage-Supply(Max): 50V; Temperature Coefficient: ±100ppm/℃; Operating Temperature: -55℃~+155℃
R33 R38 R43 R48 = RT0603BRE0750RL: LCSC Part Name: 薄膜电阻 50Ω ±0.1% 100mW; Supplier Part: C849792; Manufacturer: YAGEO(国巨); Supplier Footprint: 0603; JLCPCB Part Class: Extended Part; Datasheet: https://item.szlcsc.com/datasheet/RT0603BRE0750RL/922274.html; Supplier: LCSC; Type: Thin Film Resistor; Tolerance: ±0.1%; Power(Watts): 100mW; Voltage-Supply(Max): 75V; Temperature Coefficient: ±50ppm/℃; Operating Temperature: -55℃~+155℃
U1 = MC33174DR2G: LCSC Part Name: 单电源3.0 V至44 V低功耗运算放大器; Supplier Part: C113552; Manufacturer: onsemi(安森美); Supplier Footprint: SOIC-14; JLCPCB Part Class: Extended Part; Datasheet: https://item.szlcsc.com/datasheet/MC33174DR2G/114787.html; Supplier: LCSC; Number of Channels: 4; Maximum Power Supply Range (Vdd-Vss): 44V; Gain Bandwidth Product: 1.8MHz; Vos - Input Offset Voltage: 2mV; Input Offset Voltage Drift(Vos TC): 10uV/℃; Slew Rate: 2.1V/us; Ib - Input Bias Current: 20nA; Input Offset Current(Ios): 20nA; Input Voltage Noise Density: 32nV/√Hz@1kHz; Common Mode Rejection Ratio(CMRR): 90dB; Quiescent Current: 180uA; Output Current: 27mA; Operating Temperature: -40℃~+85℃; Single supply: 3V~44V; Dual Supply: -22V~-1.5V；1.5V~22V
U2-U5 = LM4041C12IDBZR: LCSC Part Name: 并联 45uA 100ppm/℃; Supplier Part: C133587; Manufacturer: TI(德州仪器); Supplier Footprint: SOT-23; JLCPCB Part Class: Extended Part; Datasheet: https://www.ti.com/cn/lit/gpn/lm4041b; Supplier: LCSC; Output Type: Fixed; Output Voltage: 1.225V; Output Current: 12mA; Tolerance: ±0.5%; Temperature Coefficient: 100ppm/℃; Reference Type: Parallel; Quiescent Current: 45uA; Minimum Cathode Current for Regulation: 80uA; Noise - 10Hz to 10kHz: 20uVrms; Operating Temperature: -40℃~+85℃@(Ta)
C1-C7 C16 C20 C22 C26 C27 C37 C38 C41-C47 C57-C63 = CL05B104KB54PNC: LCSC Part Name: 100nF ±10% 50V; Supplier Part: C307331; Manufacturer: SAMSUNG(三星); Supplier Footprint: 0402; JLCPCB Part Class: Basic Part; Datasheet: https://item.szlcsc.com/datasheet/CL05B104KB54PNC/291005.html; Supplier: LCSC; Tolerance: ±10%; Voltage Rating: 50V; Temperature Coefficient: X7R
C28 = CL10A106KP8NNNC: LCSC Part Name: 10uF ±10% 10V; Supplier Part: C19702; Manufacturer: SAMSUNG(三星); Supplier Footprint: 0603; JLCPCB Part Class: Basic Part; Datasheet: https://item.szlcsc.com/datasheet/CL10A106KP8NNNC/20411.html; Supplier: LCSC; Tolerance: ±10%; Voltage Rating: 10V; Temperature Coefficient: X5R
CN1 CN2 = KF2EDGV-3.5-12P: LCSC Part Name: 1x12P 3.5mm 排数:1 每排P数:12; Supplier Part: C441319; Manufacturer: KEFA(科发); Supplier Footprint: 插件,P=3.5mm; JLCPCB Part Class: Extended Part; Datasheet: https://item.szlcsc.com/datasheet/KF2EDGV-3.5-12P/441292.html; Supplier: LCSC; Connector Type: Board Side/Socket - Closed; Number of Positions or Pins: 1x12P; Pitch: 3.5mm; Color: Green; Mounting Type: Through Hole; Number of Pins: 12P; Number of Rows: 1; Number of PINs Per Row: 12; Current Rating: 10A; Voltage Rating (Max): 300V; Operating Temperature: -40℃~+105℃
CN3 CN4 = PZ254V-12-16P: LCSC Part Name: 2x8P 间距:2.54mm 方针 直插; Supplier Part: C492425; Manufacturer: XFCN(兴飞); Supplier Footprint: 插件,P=2.54mm; JLCPCB Part Class: Extended Part; Datasheet: https://item.szlcsc.com/datasheet/PZ254V-12-16P/502981.html; Supplier: LCSC; Pin Structure: 2x8P; Pitch: 2.54mm; Row Spacing: 2.54mm; Circluar Pins/Square Pins: Pin Header; Mounting Type: Through Hole; Number of Rows: 2; Number of Pins: 16P; Length of Mating Pin: 6mm; Insulation Height: 2.5mm; Length of End Connection Pin: 3mm; Contact Material: Brass; Operating Temperature: -40℃~+105℃; Color: Black
CN5 H2 H3 = PZ254V-11-02P: LCSC Part Name: 1x2P 间距:2.54mm 方针 直插; Supplier Part: C492401; Manufacturer: XFCN(兴飞); Supplier Footprint: 插件,P=2.54mm; JLCPCB Part Class: Extended Part; Datasheet: https://item.szlcsc.com/datasheet/PZ254V-11-02P/502957.html; Supplier: LCSC; Pin Structure: 1x2P; Pitch: 2.54mm; Circluar Pins/Square Pins: Pin Header; Mounting Type: Through Hole; Number of Rows: 1; Number of Pins: 2P; Current Rating: 3A; Voltage Rating (Max): 250V; Length of Mating Pin: 6mm; Insulation Height: 2.5mm; Length of End Connection Pin: 3mm; Contact Material: Brass; Operating Temperature: -40℃~+105℃; Color: Black
P8 P9 = X6521WV-2x23H-C60D30: LCSC Part Name: 2x23P 间距:2.54mm 方针; Supplier Part: C725895; Manufacturer: XKB Connection(中国星坤); Supplier Footprint: 插件,P=2.54mm; JLCPCB Part Class: Extended Part; Datasheet: https://item.szlcsc.com/datasheet/X6521WV-2x23H-C60D30/772344.html; Supplier: LCSC; Pin Structure: 2x23P; Pitch: 2.54mm; Row Spacing: 2.54mm; Circluar Pins/Square Pins: Pin Header; Number of Rows: 2; Number of Pins: 46P; Current Rating: 3A; Voltage Rating (Max): 250V; Insulation Height: 2.5mm; Contact Material: Brass; Contact Plating: Gold; Operating Temperature: -40℃~+105℃; Color: Black
R77 R78 R88 R93 R95 R97 R99 R101 R103 = 0402WGF4701TCE: LCSC Part Name: 4.7kΩ ±1% 62.5mW 厚膜电阻; Supplier Part: C25900; Manufacturer: UNI-ROYAL(厚声); Supplier Footprint: 0402; JLCPCB Part Class: Basic Part; Datasheet: https://item.szlcsc.com/datasheet/0402WGF4701TCE/26643.html; Supplier: LCSC; Type: Thick Film Resistor; Tolerance: ±1%; Power(Watts): 62.5mW; Voltage-Supply(Max): 50V; Temperature Coefficient: ±100ppm/℃; Operating Temperature: -55℃~+155℃
S1 = ZX-QC66-5.5TP: LCSC Part Name: 6*6*5.5贴片; Supplier Part: C7470153; Manufacturer: Megastar(兆星); Supplier Footprint: SMD-4P,6x6mm; JLCPCB Part Class: Extended Part; Datasheet: https://item.szlcsc.com/datasheet/ZX-QC66-5.5TP/8519159.html; Supplier: LCSC; Circuit: SPST; Actuator Style: Round Button; Operating Force: 2.6N; Mounting Type: Surface Mount,Vertical; Length: 6mm; Width: 6mm; Switch Height: 5.5mm; with Bracket: Without Bracket; Contact Current: 50mA; Voltage Rating: 12V; Actuator/Cap Color: Black; Termination Style: Gull Wing; Life: 100,000 Cycles; Operating Temperature: -30℃~+80℃
C18 = GRM155R61H224KE01D: LCSC Part Name: 220nF ±10% 50V; Supplier Part: C5159775; Manufacturer: muRata(村田); Supplier Footprint: 0402; JLCPCB Part Class: Extended Part; Datasheet: https://item.szlcsc.com/datasheet/GRM155R61H224KE01D/5803626.html; Supplier: LCSC; Tolerance: ±10%; Voltage Rating: 50V; Temperature Coefficient: X5R
C19 = RVT1H331M1010_C3032175: LCSC Part Name: 330uF ±20% 50V; Supplier Part: C3032175; Manufacturer: ROQANG(容强); Manufacturer Part: RVT1H331M1010; Supplier Footprint: SMD,D10xL10.5mm; JLCPCB Part Class: Extended Part; Datasheet: https://item.szlcsc.com/datasheet/RVT1H331M1010/3571859.html; Supplier: LCSC; Tolerance: ±20%; Voltage Rating: 50V; Diameter: 10mm; Height - Seated (Max): 10.2mm; Lifetime: 2000hrs@105℃; Operating Temperature: -40℃~+105℃
C17 C21 C48-C50 = CL10A105KB8NNNC: LCSC Part Name: 1uF ±10% 50V; Supplier Part: C15849; Manufacturer: SAMSUNG(三星); Supplier Footprint: 0603; JLCPCB Part Class: Basic Part; Datasheet: https://item.szlcsc.com/datasheet/CL10A105KB8NNNC/16531.html; Supplier: LCSC; Tolerance: ±10%; Voltage Rating: 50V; Temperature Coefficient: X5R
C23 = CC0402KRX7R9BB332: LCSC Part Name: 3.3nF ±10% 50V; Supplier Part: C107028; Manufacturer: YAGEO(国巨); Supplier Footprint: 0402; JLCPCB Part Class: Extended Part; Datasheet: https://item.szlcsc.com/datasheet/CC0402KRX7R9BB332/108244.html; Supplier: LCSC; Tolerance: ±10%; Voltage Rating: 50V; Temperature Coefficient: X7R
C24 C25 = RVT1A221M0605_C72494: LCSC Part Name: 220uF ±20% 10V; Supplier Part: C72494; Manufacturer: ROQANG(容强); Manufacturer Part: RVT1A221M0605; Supplier Footprint: SMD,D6.3xL5.4mm; JLCPCB Part Class: Extended Part; Datasheet: https://atta.szlcsc.com/upload/public/pdf/source/20170325/1490427950282.pdf; Supplier: LCSC; Tolerance: ±20%; Voltage Rating: 10V; Ripple Current: 90mA@120Hz; Diameter: 6.3mm; Height - Seated (Max): 5.4mm; Lifetime: 2000hrs@105℃; Operating Temperature: -40℃~+105℃
C39 = 0402CG470J500NT: LCSC Part Name: 47pF ±5% 50V; Supplier Part: C1567; Manufacturer: FH(风华); Supplier Footprint: 0402; JLCPCB Part Class: Basic Part; Datasheet: https://item.szlcsc.com/datasheet/0402CG470J500NT/1919.html; Supplier: LCSC; Tolerance: ±5%; Voltage Rating: 50V; Temperature Coefficient: C0G
C40 C65 = CL05A225MQ5NSNC: LCSC Part Name: 2.2uF ±20% 6.3V; Supplier Part: C12530; Manufacturer: SAMSUNG(三星); Supplier Footprint: 0402; JLCPCB Part Class: Basic Part; Datasheet: https://item.szlcsc.com/datasheet/CL05A225MQ5NSNC/13164.html; Supplier: LCSC; Tolerance: ±20%; Voltage Rating: 6.3V; Temperature Coefficient: X5R
D8-D11 D13 = SMF60CA_C41376092: LCSC Part Name: 双向TVS 60V截止 峰值浪涌电流：2.1A; Supplier Part: C41376092; Manufacturer: R+O(宏嘉诚); Supplier Footprint: SOD-123FL; JLCPCB Part Class: Extended Part; Datasheet: https://item.szlcsc.com/datasheet/SMF60CA/43144809.html; Supplier: LCSC; Polarity: Bidirectional; Reverse Stand-Off Voltage (Vrwm): 60V; Clamping Voltage: 96.8V; Peak Pulse Current (Ipp): 2.1A; Peak Pulse Power Dissipation (Ppp): 200W; Voltage - Breakdown: 73.7V; Reverse Leakage Current (Ir): 1uA; Number of Channels: 2; Operating Temperature: -55℃~+150℃; level of protection: IEC 61000-4-2; Type: TVS
D14 = ES1B-13-F: LCSC Part Name: 耐压:100V 电流:1A 反向恢复时间：25ns; Supplier Part: C106868; Manufacturer: DIODES(美台); Supplier Footprint: SMA; JLCPCB Part Class: Extended Part; Datasheet: https://item.szlcsc.com/datasheet/ES1B-13-F/108084.html; Supplier: LCSC; Voltage - Forward(Vf@If): 920mV@1A; Voltage - DC Reverse(Vr): 100V; Current - Rectified: 1A; Reverse Leakage Current (Ir): 5uA@100V; Reverse Recovery Time (trr): 25ns; Operating Junction Temperature Range: -55℃~+150℃; Non-Repetitive Peak Forward Surge Current: 30A
F1 = 0466.500NRHF: LCSC Part Name: 63V贴片式保险丝; Supplier Part: C151133; Manufacturer: Littelfuse(美国力特); Supplier Footprint: 1206; JLCPCB Part Class: Extended Part; Datasheet: https://item.szlcsc.com/datasheet/0466.500NRHF/162473.html; Supplier: LCSC; Type: Surface Mount Fuse; Current Rating: 500mA; Voltage Rating (AC): 63V; Voltage Rating (DC): 63V; Operating Temperature: -55℃~+90℃; Interrupt Rating: 50A
J1-J4 = 3551: Supplier Part: C238112; Manufacturer: Keystone; Supplier Footprint: 插件; JLCPCB Part Class: Extended Part; Datasheet: https://item.szlcsc.com/datasheet/3551/237360.html; Supplier: LCSC
L1 = CY54-6.8UH: LCSC Part Name: 6.8uH ±20%; Supplier Part: C2929430; Manufacturer: SHOU HAN(首韩); Supplier Footprint: SMD,5.8x5.2mm; JLCPCB Part Class: Extended Part; Datasheet: https://item.szlcsc.com/datasheet/CY54-6.8UH/3264912.html; Supplier: LCSC; Tolerance: ±20%; Current Rating: 2.4A; DC Resistance(DCR): 58.5mΩ
LED1-LED5 = KT-0603R: LCSC Part Name: 0603 红灯 高亮; Supplier Part: C2286; Manufacturer: KENTO; Supplier Footprint: 0603; JLCPCB Part Class: Basic Part; Datasheet: https://item.szlcsc.com/datasheet/KT-0603R/2659.html; Supplier: LCSC; Lamp Holder Type: 1.6mm x 0.8mm square LED; Illumination Color: Red; Voltage - Forward(Vf): 1.8V~2.4V; Power(Watts): 40mW; Forward Current: 20mA; Wavelength - Dominant: 615nm~630nm; Peak Wavelength: 645nm; Diode Configuration: Discrete Diode; Lens Color: Water Clear; Luminous Intensity: 300mcd; Viewing Angle: 120°; Operating Temperature: -40℃~+85℃
R71 = 1206W4F0000T5E: LCSC Part Name: 厚膜电阻 0Ω ±1%; Supplier Part: C17888; Manufacturer: UNI-ROYAL(厚声); Supplier Footprint: 1206; JLCPCB Part Class: Basic Part; Datasheet: https://item.szlcsc.com/datasheet/1206W4F0000T5E/18576.html; Supplier: LCSC; Type: Thick Film Resistor; Tolerance: ±1%; Power(Watts): 250mW; Voltage-Supply(Max): 200V; Temperature Coefficient: ±800ppm/℃; Operating Temperature: -55℃~+155℃
R72 = 0402WGF2003TCE: LCSC Part Name: 200kΩ ±1% 62.5mW 厚膜电阻; Supplier Part: C25764; Manufacturer: UNI-ROYAL(厚声); Supplier Footprint: 0402; JLCPCB Part Class: Basic Part; Datasheet: https://item.szlcsc.com/datasheet/0402WGF2003TCE/26507.html; Supplier: LCSC; Type: Thick Film Resistor; Tolerance: ±1%; Power(Watts): 62.5mW; Voltage-Supply(Max): 50V; Temperature Coefficient: ±100ppm/℃; Operating Temperature: -55℃~+155℃
R73 = RC0402FR-0714KL: LCSC Part Name: 厚膜电阻 14kΩ ±1% 62.5mW; Supplier Part: C327372; Manufacturer: YAGEO(国巨); Supplier Footprint: 0402; JLCPCB Part Class: Extended Part; Datasheet: https://atta.szlcsc.com/upload/public/pdf/source/20181031/C327372_D664387651520BEEF49835DE044ADDF1.pdf; Supplier: LCSC; Type: Thick Film Resistors; Tolerance: ±1%; Temperature Coefficient: ±100ppm/℃; Operating Temperature Range: -55℃~+155℃
R74 = RC0402FR-07115KL: LCSC Part Name: 厚膜电阻 115kΩ ±1% 62.5mW; Supplier Part: C273341; Manufacturer: YAGEO(国巨); Supplier Footprint: 0402; JLCPCB Part Class: Extended Part; Datasheet: https://atta.szlcsc.com/upload/public/pdf/source/20180821/C275644_0D56F95EFF785E7D9A1FEF436B37DA78.pdf; Supplier: LCSC; Type: Thick Film Resistors; Tolerance: ±1%; Temperature Coefficient: ±100ppm/℃; Operating Temperature Range: -55℃~+155℃
R75 = 0402WGF2202TCE: LCSC Part Name: 22kΩ ±1% 62.5mW 厚膜电阻; Supplier Part: C25768; Manufacturer: UNI-ROYAL(厚声); Supplier Footprint: 0402; JLCPCB Part Class: Basic Part; Datasheet: https://item.szlcsc.com/datasheet/0402WGF2202TCE/26511.html; Supplier: LCSC; Type: Thick Film Resistor; Tolerance: ±1%; Power(Watts): 62.5mW; Voltage-Supply(Max): 50V; Temperature Coefficient: ±100ppm/℃; Operating Temperature: -55℃~+155℃
R49 R54 R59 R64 R76 R82 = 0603WAF4700T5E: LCSC Part Name: 470Ω ±1% 100mW 厚膜电阻; Supplier Part: C23179; Manufacturer: UNI-ROYAL(厚声); Supplier Footprint: 0603; JLCPCB Part Class: Basic Part; Datasheet: https://item.szlcsc.com/datasheet/0603WAF4700T5E/23906.html; Supplier: LCSC; Type: Thick Film Resistor; Tolerance: ±1%; Power(Watts): 100mW; Voltage-Supply(Max): 75V; Temperature Coefficient: ±100ppm/℃; Operating Temperature: -55℃~+155℃
SW8 = SS12D07VG4 087: LCSC Part Name: SS12D07VG4; Supplier Part: C2939726; Manufacturer: SHOU HAN(首韩); Supplier Footprint: 插件,8.7x4.4mm; JLCPCB Part Class: Extended Part; Datasheet: https://item.szlcsc.com/datasheet/SS12D07VG4%2520087/3301205.html; Supplier: LCSC; Circuit: SPDT; Termination Style: PC Pin; Length: 8.7mm; Width: 4.4mm; Switch Height: 4.7mm; Mounting Type: Through Hole; Current Rating: 500mA; Voltage Rating: 50V; Life: 5,000 cycles; Operating Temperature: -10℃~+50℃
U10 = AP64350SP-13: LCSC Part Name: 降压型 3.5A 3.8V~40V; Supplier Part: C2071691; Manufacturer: DIODES(美台); Supplier Footprint: SO-8-EP; JLCPCB Part Class: Extended Part; Datasheet: https://item.szlcsc.com/datasheet/AP64350SP-13/2163274.html; Supplier: LCSC; Function: Step-down type; Voltage - Supply: 3.8V~40V; Output Voltage: 800mV~39V; Output Current: 3.5A; Frequency - Switching: 100kHz~2.2MHz; Operating Temperature: -40℃~+125℃; Synchronous Rectifier: Yes; Number of Outputs: 1; Topology: Buck; Quiescent Current: 22uA; Switch tube (built-in/external): Built-in; Output Type: Adjustable; Features: Light load efficient mode；External compensation；Frequency synchronization；Cycle-by-cycle current limiting；Overcurrent Protection；EMI optimization (spread spectrum)；Hiccup current limiting
U17 = AP7313-18SAG-7: LCSC Part Name: 1.8V 150mA 6V; Supplier Part: C460373; Manufacturer: DIODES(美台); Supplier Footprint: SOT-23; JLCPCB Part Class: Extended Part; Datasheet: https://item.szlcsc.com/datasheet/AP7313-18SAG-7/464802.html; Supplier: LCSC; Output Configuration: Positive; Voltage - Supply: 6V; Output Voltage: 1.8V; Output Current: 150mA; Power Supply Rejection Ratio (PSRR): 65dB@(100Hz); Voltage Dropout: 300mV@(150mA); standby current: 65uA; Features: Over Current Protection；Short Circuit Protection；Thermal shutdown; Operating Temperature: -40℃~+85℃@(Ta); Output Type: Fixed; Number of Outputs: 1
D1-D7 D15-D20 = CDBU0130-HF: LCSC Part Name: 电压:30V 电流:100mA; Supplier Part: C2886021; Manufacturer: Comchip(典琦); Supplier Footprint: SOD-523F; JLCPCB Part Class: Extended Part; Datasheet: https://item.szlcsc.com/datasheet/CDBU0130-HF/3097060.html; Supplier: LCSC; Diode Configuration: Independent; Voltage - Forward(Vf@If): 440mV@100mA; Voltage - DC Reverse(Vr): 30V; Current - Rectified: 100mA; Reverse Leakage Current (Ir): 30uA@30V
U42 = HC-RJ45-5224-1-6: LCSC Part Name: 直插 不带LED; Supplier Part: C3010562; Manufacturer: HCTL(华灿天禄); Supplier Footprint: 插件; JLCPCB Part Class: Extended Part; Datasheet: https://item.szlcsc.com/datasheet/HC-RJ45-5224-1-6/3510115.html; Supplier: LCSC; Connector Type: RJ45 Jack; Mounting Type: Through Hole; Number of Ports: 1; LED: Non-LED; Shielding: Unshielded; Contact Material: Phosphor Bronze; Contact Plating: Gold
U43 = TLA2528IRTER: LCSC Part Name: 小型8通道12位ADC，具有I²C接口及GPIO; Supplier Part: C2866175; Manufacturer: TI(德州仪器); Supplier Footprint: WQFN-16-EP(3x3); JLCPCB Part Class: Extended Part; Datasheet: https://www.ti.com/cn/lit/gpn/tla2528; Supplier: LCSC; Resolution(Bits): 12; number of channels: 8; Voltage - Supply: 2.35V~5.5V；1.65V~5.5V; Interface: I2C; differential input: No; Integral non - linearity: 0.5LSB; Operating Temperature: -40℃~+85℃; Signal-to-Noise Ratio: 71.5dB; Clock/Oscillator: Built-in; Voltage Reference: External; ADC architecture: SAR; Supply Current (Iq): 5uA
BT1 = BS-16-B4AK003: LCSC Part Name: MYOUNG(美阳)电池底座BS-1632-1 Sn 耐高温材质/符合SMT回流焊工艺标准 适装CR1632电池，SMD平贴; Supplier Part: C964732; Manufacturer: MYOUNG(美阳); JLCPCB Part Class: Extended Part; Datasheet: https://item.szlcsc.com/datasheet/BS-16-B4AK003/1049698.html; Supplier: LCSC; Type: Battery base; Operating Temperature: -25~85℃; Contact material: Phosphor bronze; Contact coating: Tin plated; Applicable battery specifications: CR1632
R89 = 0603WAF1200T5E: LCSC Part Name: 120Ω ±1% 100mW 厚膜电阻; Supplier Part: C22787; Manufacturer: UNI-ROYAL(厚声); Supplier Footprint: 0603; JLCPCB Part Class: Basic Part; Datasheet: https://item.szlcsc.com/datasheet/0603WAF1200T5E/23514.html; Supplier: LCSC; Type: Thick Film Resistor; Tolerance: ±1%; Power(Watts): 100mW; Voltage-Supply(Max): 75V; Temperature Coefficient: ±100ppm/℃; Operating Temperature: -55℃~+155℃
U12 = HMHA2801R2: LCSC Part Name: DC输入 隔离电压(rms):3750V; Supplier Part: C457670; Manufacturer: onsemi(安森美); Supplier Footprint: SOIC-4-175mil; JLCPCB Part Class: Extended Part; Datasheet: https://atta.szlcsc.com/upload/public/pdf/source/20191129/C457670_A1B598643A31390395889194ACFA4ACD.pdf; Supplier: LCSC; Input voltage type: DC; Output Type: 光电三极管; Forward Voltage: 1.3V; Output Current: 50mA; Isolation Voltage(rms): 3.75kV; Reverse Voltage: 6V; Receiving End Voltage: 80V; Number of Outputs: 1; Collector-Emitter Saturation Voltage (Vce(sat)@Ic,IF): 300mV@2mA,10mA; Rise time: 3us@2mA,100Ω; Fall time: 3us@2mA,100Ω; Operating Temperature: -55℃~+100℃
U13 U14 = H11L1S(TA): LCSC Part Name: DC输入 1通道 隔离电压(rms):5000V; Supplier Part: C78589; Manufacturer: EVERLIGHT(亿光); Supplier Footprint: SOP-6-2.54mm; JLCPCB Part Class: Extended Part; Datasheet: https://www.everlighteurope.com/custom/files/datasheets/DPC-0000022.pdf; Supplier: LCSC; Input Type: DC; Voltage - Supply: 3V~15V; Isolation Voltage(Vrms): 5kV; Data Rate: 1Mbit/s; Number of Channels: 1; Operating Temperature: -55℃~+100℃; Input threshold current: 1.6mA; power dissipation: 250mW
U15 = SP485EEN-L/TR: LCSC Part Name: 增强型低功耗半双工 RS-485 收发器; Supplier Part: C6855; Manufacturer: MaxLinear(迈凌); Supplier Footprint: SOIC-8; JLCPCB Part Class: Basic Part; Datasheet: https://item.szlcsc.com/datasheet/SP485EEN-L%252FTR/7327.html; Supplier: LCSC; Type: Transceiver; Number of Drivers: 1; Number of Receivers: 1; Voltage - Supply: 4.75V~5.25V; Data Rate: 10Mbps; ESD Protect: ±15kV; Operating Temperature: -40℃~+85℃; Quiescent Supply Current: 900uA; Communication Mode: Half-Duplex
U16 = DS1307DTR(XBLW): LCSC Part Name: DS1307DTR; Supplier Part: C18723598; Manufacturer: XBLW(芯伯乐); Supplier Footprint: SOP-8; JLCPCB Part Class: Extended Part; Datasheet: https://atta.szlcsc.com/upload/public/pdf/source/20231019/5F437FF898D879F45FF6251D729F1B2C.pdf; Supplier: LCSC; Interface: I2C; Operating Voltage: 4.5V~5.5V; The alarm clock output: 有; Operating Temperature: -40℃~+85℃
X2 = Q13FC13500004_C32346: LCSC Part Name: 32.768kHz ±20ppm 12.5pF; Supplier Part: C32346; Manufacturer: EPSON(爱普生); Manufacturer Part: Q13FC13500004; Supplier Footprint: SMD3215-2P; JLCPCB Part Class: Basic Part; Datasheet: https://item.szlcsc.com/datasheet/Q13FC13500004/33310.html; Supplier: LCSC; Type: Crystal Oscillator; Normal temperature Frequency Tolerance: ±20ppm; Load Capacitance: 12.5pF; Equivalent Series Resistance(ESR): 70kΩ; Operating Temperature: -40℃~+85℃
C12-C15 = CC0603JRX7R9BB103: LCSC Part Name: 10nF ±5% 50V; Supplier Part: C115056; Manufacturer: YAGEO(国巨); Supplier Footprint: 0603; JLCPCB Part Class: Extended Part; Datasheet: https://item.szlcsc.com/datasheet/CC0603JRX7R9BB103/116301.html; Supplier: LCSC; Tolerance: ±5%; Voltage Rating: 50V; Temperature Coefficient: X7R
R50 R55 R60 R65 = 0603WAF3300T5E: LCSC Part Name: 330Ω ±1% 100mW 厚膜电阻; Supplier Part: C23138; Manufacturer: UNI-ROYAL(厚声); Supplier Footprint: 0603; JLCPCB Part Class: Basic Part; Datasheet: https://atta.szlcsc.com/upload/public/pdf/source/20200306/C422600_1E6D84923E4A46A82E41ADD87F860B5C.pdf; Supplier: LCSC; Type: Thick Film Resistors; Tolerance: ±1%; Temperature Coefficient: ±100ppm/℃; Operating Temperature Range: -55℃~+155℃
R51 R56 R61 R66 = 0603WAF2200T5E: LCSC Part Name: 220Ω ±1% 100mW 厚膜电阻; Supplier Part: C22962; Manufacturer: UNI-ROYAL(厚声); Supplier Footprint: 0603; JLCPCB Part Class: Basic Part; Datasheet: https://atta.szlcsc.com/upload/public/pdf/source/20200306/C422600_1E6D84923E4A46A82E41ADD87F860B5C.pdf; Supplier: LCSC; Type: Thick Film Resistors; Tolerance: ±1%; Temperature Coefficient: ±100ppm/℃; Operating Temperature Range: -55℃~+155℃
R52 R57 R62 R67 = 0603WAF1001T5E: LCSC Part Name: 1kΩ ±1% 100mW 厚膜电阻; Supplier Part: C21190; Manufacturer: UNI-ROYAL(厚声); Supplier Footprint: 0603; JLCPCB Part Class: Basic Part; Datasheet: https://item.szlcsc.com/datasheet/0603WAF1001T5E/21904.html; Supplier: LCSC; Type: Thick Film Resistor; Tolerance: ±1%; Power(Watts): 100mW; Voltage-Supply(Max): 75V; Temperature Coefficient: ±100ppm/℃; Operating Temperature: -55℃~+155℃
R53 R58 R63 R68 = 0603WAF1000T5E: LCSC Part Name: 100Ω ±1% 100mW 厚膜电阻; Supplier Part: C22775; Manufacturer: UNI-ROYAL(厚声); Supplier Footprint: 0603; JLCPCB Part Class: Basic Part; Datasheet: https://atta.szlcsc.com/upload/public/pdf/source/20200306/C422600_1E6D84923E4A46A82E41ADD87F860B5C.pdf; Supplier: LCSC; Type: Thick Film Resistors; Tolerance: ±1%; Temperature Coefficient: ±200ppm/℃; Operating Temperature Range: -55℃~+155℃
TR1-TR4 = Z0107MN 5AA4: LCSC Part Name: 1A三端双向可控硅; Supplier Part: C71218; Manufacturer: ST(意法半导体); Supplier Footprint: SOT-223; JLCPCB Part Class: Extended Part; Datasheet: https://item.szlcsc.com/datasheet/Z0107MN%25205AA4/72317.html; Supplier: LCSC; Peak off - state voltage(Vdrm): 600V; Current - On State(It(RMS)): 1A; Current - Surge(Itsm@f): 8A@50Hz; Average Gate Power Dissipation (PG(AV)): 1W; Voltage - On State(Vtm): 1.6V; Current - Gate Trigger(Igt): 5mA; Gate Trigger   Voltage (Vgt): 1.3V; Holding Current (Ih): 10mA; Operating Temperature: -40℃~+125℃
U6-U9 = CTM3053(T1): LCSC Part Name: 双向可控硅 无过零电路 1通道; Supplier Part: C453470; Manufacturer: CT MICRO; Supplier Footprint: SOP-4-2.54mm; JLCPCB Part Class: Extended Part; Datasheet: https://atta.szlcsc.com/upload/public/pdf/source/20191108/C453470_DA584F87D99F387FEC7421CDFD08A9D4.pdf; Supplier: LCSC; SCR Type: Two-way thyristor; Zero Crossing Circuit: None; Forward Voltage: 1.5V; Isolation Voltage(rms): 3.75kV; Forward Current: 60mA; Load Voltage: 600V; Static dv/dt: 1000V/us; Number of Outputs: 1; Operating Temperature: -55℃~+100℃
U40 = ULN2003ADR: LCSC Part Name: 高压、大电流达林顿晶体管阵列; Supplier Part: C7512; Manufacturer: TI(德州仪器); Supplier Footprint: SOIC-16; JLCPCB Part Class: Basic Part; Datasheet: https://www.ti.com/cn/lit/gpn/uln2003a; Supplier: LCSC; number of channels: Seven channels; Collector - Emitter Voltage VCEO: 50V; Current - Collector(Ic): 500mA; Voltage - Input(Max): 30V; Output Leakage Current(Icex): 50uA; Voltage - Forward(Vf): 1.7V; Reverse Leakage Current (Ir): 50uA; Input Capacitiance(Ci): 15pF
R3 R7 R11 R15 R19 R23 R27 = 0402WGF2201TCE: LCSC Part Name: 2.2kΩ ±1% 62.5mW 厚膜电阻; Supplier Part: C25879; Manufacturer: UNI-ROYAL(厚声); Supplier Footprint: 0402; JLCPCB Part Class: Basic Part; Datasheet: https://item.szlcsc.com/datasheet/0402WGF2201TCE/26622.html; Supplier: LCSC; Type: Thick Film Resistor; Tolerance: ±1%; Power(Watts): 62.5mW; Voltage-Supply(Max): 50V; Temperature Coefficient: ±100ppm/℃; Operating Temperature: -55℃~+155℃
R4 R8 R12 R16 R20 R24 R28 = 0402WGF909JTCE: LCSC Part Name: 90.9Ω ±1% 62.5mW 厚膜电阻; Supplier Part: C129693; Manufacturer: UNI-ROYAL(厚声); Supplier Footprint: 0402; JLCPCB Part Class: Extended Part; Datasheet: https://item.szlcsc.com/datasheet/0402WGF909JTCE/140979.html; Supplier: LCSC; Type: Thick Film Resistor; Tolerance: ±1%; Power(Watts): 62.5mW; Voltage-Supply(Max): 50V; Temperature Coefficient: ±200ppm/℃; Operating Temperature: -55℃~+155℃
SW1-SW7 = SMQS-03R-TP: LCSC Part Name: 间距2.54mm 平拨,凸起式3位拨码开关; Supplier Part: C5299504; Manufacturer: SM Switch; Supplier Footprint: 插件,P=2.54mm; JLCPCB Part Class: Extended Part; Datasheet: https://item.szlcsc.com/datasheet/SMQS-03R-TP/6048192.html; Supplier: LCSC; Type: Slide, Rocked; Number of Positions: 3; Lead Pitch: 2.54mm; Current Rating: 25mA; Voltage Rating: 24V; Operating Temperature: -40℃~+85℃; Operating Life: 5000 Cycles; Color: Red
D12 = MM3Z3V3ST1G: LCSC Part Name: 独立式 耐压:3.3V 电流:5uA@1.0V; Supplier Part: C182011; Manufacturer: onsemi(安森美); Supplier Footprint: SOD-323; JLCPCB Part Class: Extended Part; Datasheet: https://item.szlcsc.com/datasheet/MM3Z3V3ST1G/193409.html; Supplier: LCSC; Diode Configuration: 1 Independent; Zener Voltage(Nom): 3.3V; Reverse Leakage Current (Ir): 5uA@1V; Zener Voltage(Range): 3.32V~3.53V; Pd - Power Dissipation: 300mW; Impedance(Zzt): 95Ω; Impedance(Zzk): 1kΩ; Operating Junction Temperature Range: -65℃~+150℃
H4 = PZ254V-11-05P: LCSC Part Name: 1x5P 间距:2.54mm 方针 直插; Supplier Part: C492404; Manufacturer: XFCN(兴飞); Supplier Footprint: 插件,P=2.54mm; JLCPCB Part Class: Extended Part; Datasheet: https://item.szlcsc.com/datasheet/PZ254V-11-05P/502960.html; Supplier: LCSC; Pin Structure: 1x5P; Pitch: 2.54mm; Circluar Pins/Square Pins: Pin Header; Mounting Type: Through Hole; Number of Rows: 1; Number of Pins: 5P; Current Rating: 3A; Voltage Rating (Max): 250V; Length of Mating Pin: 6mm; Insulation Height: 2.5mm; Length of End Connection Pin: 3mm; Contact Material: Brass; Operating Temperature: -40℃~+105℃; Color: Black
R69 R70 = RC0402FR-076K8L: LCSC Part Name: 厚膜电阻 6.8kΩ ±1% 62.5mW; Supplier Part: C93940; Manufacturer: YAGEO(国巨); Supplier Footprint: 0402; JLCPCB Part Class: Extended Part; Datasheet: https://item.szlcsc.com/datasheet/RC0402FR-076K8L/95138.html; Supplier: LCSC; Type: Thick Film Resistor; Tolerance: ±1%; Power(Watts): 62.5mW; Voltage-Supply(Max): 50V; Temperature Coefficient: ±100ppm/℃; Operating Temperature: -55℃~+155℃
R104-R106 = FRC0402F3302TS: LCSC Part Name: 33kΩ ±1% 62.5mW 厚膜电阻; Supplier Part: C2909350; Manufacturer: FOJAN(富捷); Supplier Footprint: 0402; JLCPCB Part Class: Extended Part; Datasheet: https://item.szlcsc.com/datasheet/FRC0402F3302TS/3186285.html; Supplier: LCSC; Type: Thick Film Resistor; Tolerance: ±1%; Power(Watts): 62.5mW; Voltage-Supply(Max): 50V; Temperature Coefficient: ±100ppm/℃; Operating Temperature: -55℃~+155℃
TP1 = Test-Point
U44 = MSPM0C1103SDDFR: LCSC Part Name: 混合信号微控制器; Supplier Part: C35962001; Manufacturer: TI(德州仪器); Supplier Footprint: TSOT-23-8; JLCPCB Part Class: Extended Part; Datasheet: https://www.ti.com.cn/cn/lit/ds/symlink/mspm0c1103.pdf; Supplier: LCSC; CPU Core: ARM Cortex-M0+; CPU Maximum Speed: 24MHz; Core Size: 32 Bit; Program Storage Size: 8KB; Program Memory Type: FLASH; RAM Size: 1KB; Number of I/O: 6; Oscillator Type: Built-in+External; Voltage - Supply: 1.62V~3.6V; Operating Temperature: -40℃~+125℃; Features: Window watchdog (WWDG)；Undervoltage detection (BOR/LVD/LVR/LVI)；Power-on reset (POR)；Built-in general-purpose timer；Built-in temperature sensor；Hardware CRC；External pin reset (NRST)

## Nets
3V3: C27.2 C28.2 C38.2 C49.2 P9.3 P9.4 R77.2 R78.2 R82.2 R84.2 R86.2 R88.2 U14.6(VCC) U16.8(VCC) U43.10(DVDD)
5V0: C24.1 C25.1 C26.2 C37.2 C48.2 CN2.9 CN3.6 CN4.6 L1.2 LED1.1(A) LED2.1(A) LED3.1(A) LED4.1(A) LED5.1(A) P9.5 P9.6 R50.2 R55.2 R60.2 R65.2 R74.2 R85.2 R87.1 U12.4(C) U13.6(VCC) U15.8(VCC) U17.1(IN) U40.9(COM) U43.7(AVDD)
24VAC: CN1.12 SW8.2 U42.1
24VAC_SW: R52.1 R53.1 R57.1 R58.1 R62.1 R63.1 R67.1 R68.1 R71.1 SW8.3 TR1.1(M1) TR2.1(M1) TR3.1(M1) TR4.1(M1)
24VURDC: C18.2 C19.1 C20.2 D14.1(K) R69.2 R70.2 U1.4(VCC) U10.2(VIN)
VBAT: BT1.1(+) H2.1
VDD_WDT: C16.2 C17.2 C65.2 D12.1 H4.1 R69.1 R70.1 R104.2 R105.2 R106.2 U44.4(VDD)
A01: CN1.2 R30.2 R33.1
A02: CN1.1 R35.2 R38.1
A03: CN2.12 R40.2 R43.1
A04: CN2.11 R45.2 R48.1
AIN1: C57.2 D15.1(K) R92.1 R93.2 U43.16(AIN1/GPIO1)
AIN2: C58.2 D16.1(K) R94.1 R95.2 U43.1(AIN2/GPIO2)
AIN3: C59.2 D17.1(K) R96.1 R97.2 U43.2(AIN3/GPIO3)
AIN4: C60.2 D18.1(K) R98.1 R99.2 U43.3(AIN4/GPIO4)
AIN5: C61.2 D19.1(K) R100.1 R101.2 U43.4(AIN5/GPIO5)
AIN6: C62.2 D20.1(K) R102.1 R103.2 U43.5(AIN6/GPIO6)
ANALOG_VDD: C40.2 P9.31 R1.2 R5.2 R9.2 R13.2 R17.2 R21.2 R25.2 U17.2(OUT)
B+: CN2.2 H3.2 U15.6(A)
B-: CN2.1 R89.2 U15.7(B)
BB_BLINK: CN3.16 CN4.16 P9.11 R104.1 U44.1(PA27/A0)
BB_OC1: P8.15 U40.1(1B)
BB_OC2: P8.18 U40.2(2B)
BB_OC3: P8.17 U40.3(3B)
BB_OC4: P8.25 U40.4(4B)
BB_RL_P1: CN3.8 P8.12
BB_RL_P2: CN3.10 P8.11
BB_RL_P3: CN3.12 P8.13
BB_RL_P4: CN3.14 P8.16
BB_RL_P5: CN4.8 P8.8
BB_RL_P6: CN4.10 P8.7
BB_RL_P7: CN4.12 P8.10
BB_RL_P8: CN4.14 P8.9
COM: BT1.2(-) C1.1 C2.1 C3.1 C4.1 C5.1 C6.1 C7.1 C8.1 C9.1 C10.1 C11.1 C16.1 C17.1 C18.1 C19.2 C20.1 C21.1 C23.1 C24.2 C25.2 C26.1 C27.1 C28.1 C37.1 C38.1 C39.1 C40.1 C41.1 C42.1 C43.1 C44.1 C45.1 C46.1 C47.1 C48.1 C49.1 C50.1 C57.1 C58.1 C59.1 C60.1 C61.1 C62.1 C63.2 C65.1 CN1.3 CN1.11 CN2.3 CN2.8 CN2.10 CN3.2 CN3.4 CN4.2 CN4.4 D1.2(A) D2.2(A) D3.2(A) D4.2(A) D5.2(A) D6.2(A) D7.2(A) D12.2 D15.2(A) D16.2(A) D17.2(A) D18.2(A) D19.2(A) D20.2(A) H4.2 P8.1 P8.2 P9.1 P9.2 P9.33 P9.43 P9.44 P9.45 P9.46 R29.1 R34.1 R39.1 R44.1 R72.1 R75.1 R76.1 R83.1 R91.1 R93.1 R95.1 R97.1 R99.1 R101.1 R103.1 S1.1 S1.2 SW1.4 SW1.5 SW2.4 SW2.5 SW3.4 SW3.5 SW4.4 SW4.5 SW5.4 SW5.5 SW6.4 SW6.5 SW7.4 SW7.5 U1.11(VEE) U2.2(-) U3.2(-) U4.2(-) U5.2(-) U10.7(GND) U13.5(GND) U14.5(GND) U15.2(RE#) U15.5(GND) U16.4(GND) U17.3(GND) U40.5(5B) U40.6(6B) U40.7(7B) U40.8(E) U42.8 U43.9(GND) U43.17(GND) U44.3(VSS)
EARTH_COM: D8.1(K) D9.1(K) D10.1(K) D11.1(K) D13.1(K) J1.1 J2.1 J3.1 J4.1
EN_485: P9.17 U12.2(C)
ENABLE: C21.2 R106.1 U10.3(EN) U44.8(PA24/A3)
I2C2_SCL: P9.20 R77.1 U16.6(SCL) U43.13(SCL)
I2C2_SDA: P9.19 R78.1 U16.5(SDA) U43.14(SDA)
IN1: R92.2 U42.2
IN2: R94.2 U42.3
IN3: R96.2 U42.4
IN4: R98.2 U42.5
IN5: R100.2 U42.6
IN6: R102.2 U42.7
MS_SWCLK: H4.4 U44.7(PA20/A6/SWCLK)
MS_SWDIO: H4.3 U44.6(PA19/SWDIO)
NRST: C63.1 H4.5 R105.1 U44.2(PA1/NRST)
PWM1: P9.13 R31.1
PWM2: P9.15 R36.1
PWM3: P8.20 R41.1
PWM4: P8.14 R46.1
T1: C12.2 CN2.7 D8.2(A) TR1.2(M2) TR1.4(M2) U6.4(MT1)
T1_LED: R49.1 U6.2(Cathode) U40.16(1C)
T2: C13.2 CN2.6 D9.2(A) TR2.2(M2) TR2.4(M2) U7.4(MT1)
T2_LED: R54.1 U7.2(Cathode) U40.15(2C)
T3: C14.2 CN2.5 D10.2(A) TR3.2(M2) TR3.4(M2) U8.4(MT1)
T3_LED: R59.1 U8.2(Cathode) U40.14(3C)
T4: C15.2 CN2.4 D11.2(A) TR4.2(M2) TR4.4(M2) U9.4(MT1)
T4_LED: R64.1 U9.2(Cathode) U40.13(4C)
UA1: C1.2 C41.2 D1.1(K) P9.40 R2.1 R3.1
UA2: C2.2 C47.2 D2.1(K) P9.39 R6.1 R7.1
UA3: C3.2 C42.2 D3.1(K) P9.38 R10.1 R11.1
UA4: C4.2 C46.2 D4.1(K) P9.37 R14.1 R15.1
UA5: C5.2 C44.2 D5.1(K) P9.34 R18.1 R19.1
UA6: C6.2 C45.2 D6.1(K) P9.35 R22.1 R23.1
UA7: C7.2 C43.2 D7.1(K) P9.36 R26.1 R27.1
UART1_RX: CN5.2 P9.25
UART1_TX: CN5.1 P9.23
UART2_RXD: P9.21 R86.1 U14.4(VO)
UART2_TXD: P9.22 U13.2(CAT)
UI1: CN1.10 R2.2 R4.2 SW1.1
UI2: CN1.9 R6.2 R8.2 SW2.1
UI3: CN1.8 R10.2 R12.2 SW3.1
UI4: CN1.7 R14.2 R16.2 SW4.1
UI5: CN1.6 R18.2 R20.2 SW5.1
UI6: CN1.5 R22.2 R24.2 SW6.1
UI7: CN1.4 R26.2 R28.2 SW7.1
$1N2630: R27.2 SW7.2
$1N2631: R28.1 SW7.3
$1N2635: R21.1 SW6.6
$1N2636: R25.1 SW7.6
$1N2638: R15.2 SW4.2
$1N2639: R16.1 SW4.3
$1N2649: R13.1 SW4.6
$1N2651: R12.1 SW3.3
$1N2654: R11.2 SW3.2
$1N2656: R9.1 SW3.6
$1N2660: R5.1 SW2.6
$1N2662: R17.1 SW5.6
$1N2667: R8.1 SW2.3
$1N2669: R3.2 SW1.2
$1N2673: R1.1 SW1.6
$1N2674: R7.2 SW2.2
$1N2677: R4.1 SW1.3
$1N2679: R24.1 SW6.3
$1N2680: R23.2 SW6.2
$1N2683: R20.1 SW5.3
$1N2684: R19.2 SW5.2
$2N1158: C10.2 R42.2 U1.10(IN3+)
$2N1160: R39.2 R40.1 U1.9(IN3-)
$2N1161: R41.2 R42.1 U4.1(+)
$2N1164: R43.2 U1.8(OUT3)
$2N1167: R38.2 U1.7(OUT2)
$2N1168: R31.2 R32.1 U2.1(+)
$2N1169: C8.2 R32.2 U1.3(IN1+)
$2N1170: R29.2 R30.1 U1.2(IN1-)
$2N1175: R34.2 R35.1 U1.6(IN2-)
$2N1177: R33.2 U1.1(OUT1)
$2N1179: C9.2 R37.2 U1.5(IN2+)
$2N1181: R36.2 R37.1 U3.1(+)
$2N1556: R46.2 R47.1 U5.1(+)
$2N1558: R48.2 U1.14(OUT4)
$2N1560: R44.2 R45.1 U1.13(IN4-)
$2N1561: C11.2 R47.2 U1.12(IN4+)
$5N734: R50.1 U6.1(Anode)
$5N1044: R51.2 R52.2 TR1.3(G)
$5N1049: R51.1 U6.3(MT2)
$5N1081: C12.1 R53.2
$5N1545: C13.1 R58.2
$5N1559: R56.1 U7.3(MT2)
$5N1561: R56.2 R57.2 TR2.3(G)
$5N1574: R55.1 U7.1(Anode)
$5N1956: C14.1 R63.2
$5N1970: R61.1 U8.3(MT2)
$5N1972: R61.2 R62.2 TR3.3(G)
$5N1985: R60.1 U8.1(Anode)
$5N2367: C15.1 R68.2
$5N2381: R66.1 U9.3(MT2)
$5N2383: R66.2 R67.2 TR4.3(G)
$5N2396: R65.1 U9.1(Anode)
$5N3461: LED1.2(K) R49.2
$5N3567: LED2.2(K) R54.2
$5N3676: LED3.2(K) R59.2
$5N3780: LED4.2(K) R64.2
$7N308: F1.1 R71.2
$7N389: D13.2(A) D14.2(A) F1.2
$7N1267: C22.2 U10.1(BST)
$7N1272: C22.1 L1.1 U10.8(SW)
$7N1516: R74.1 R75.2 U10.5(FB)
$7N1806: C39.2 R73.2 U10.6(COMP)
$7N1822: C23.2 R73.1
$7N2176: R72.2 U10.4(RT/CLK)
$7N7163: LED5.2(K) R76.2
$8N9460: P9.16 S1.3 S1.4
$10N786: R82.1 U12.1(A)
$10N792: R83.2 U12.3(E) U15.3(DE)
$10N793: U14.2(CAT) U15.1(RO)
$10N802: R84.1 U13.1(AN)
$10N803: R87.2 U14.1(AN)
$10N804: R85.1 U13.4(VO) U15.4(DI)
$10N1107: U16.2(X2) X2.1
$10N1108: U16.1(X1) X2.2
$10N1109: R88.1 U16.7(SQW/OUT)
$10N1791: H2.2 U16.3(VBAT)
$10N1916: H3.1 R89.1
$11N594: C50.2 U43.8(DECAP)
$11N738: R91.2 U43.11(ADDR)
$12N832: TP1.1 U44.5(PA0)

Not connected (* = marked no-connect by the designer): CN3 1 3 5 7 9 11 13 15; CN4 1 3 5 7 9 11 13 15; P8 3 4 5 6 19 21 22 23 24 26 27 28 29 30 31 32 33 34 35 36 37 38 39 40 41 42 43 44 45 46; P9 7 8 9 10 12 14 18 24 26 27 28 29 30 32 41 42; SW8 1 4 5; U2 3(NC)*; U3 3(NC)*; U4 3(NC)*; U5 3(NC)*; U10 9(EP); U13 3(NC)*; U14 3(NC)*; U40 10(7C) 11(6C) 12(5C); U43 6(AIN7/GPIO7) 12(NC)* 15(AIN0/GPIO0)

## Notes on the sheets
sheet 1
- 1: Thermistor
  2: 0-10 VDC
  3: 4-20 mA
- 1: Thermistor
  2: 0-10 VDC
  3: 4-20 mA
- 1: Thermistor
  2: 0-10 VDC
  3: 4-20 mA
- 1: Thermistor
  2: 0-10 VDC
  3: 4-20 mA
- 1: Thermistor
  2: 0-10 VDC
  3: 4-20 mA
- 1: Thermistor
  2: 0-10 VDC
  3: 4-20 mA
- Universal Inputs (7 Channels)
- 1: Thermistor
  2: 0-10 VDC
  3: 4-20 mA
sheet 2
- Analog Output - 1
- Analog Output - 2
- Analog Output - 3
- Analog Output - 4
sheet 3
- TRIAC - 1
- TRIAC - 2
- TRIAC - 3
- TRIAC - 4
sheet 4
- 24VAC to 5V Power Regulator
sheet 5
- IO Connectors
- BeagleBone Connector
sheet 6
- RS485 Interface
- Real Time Clock
- ADDR: 0x68
sheet 8
- Watchdog Timer (WDT)
